# Altium project solar-charger-2420.PrjPcb
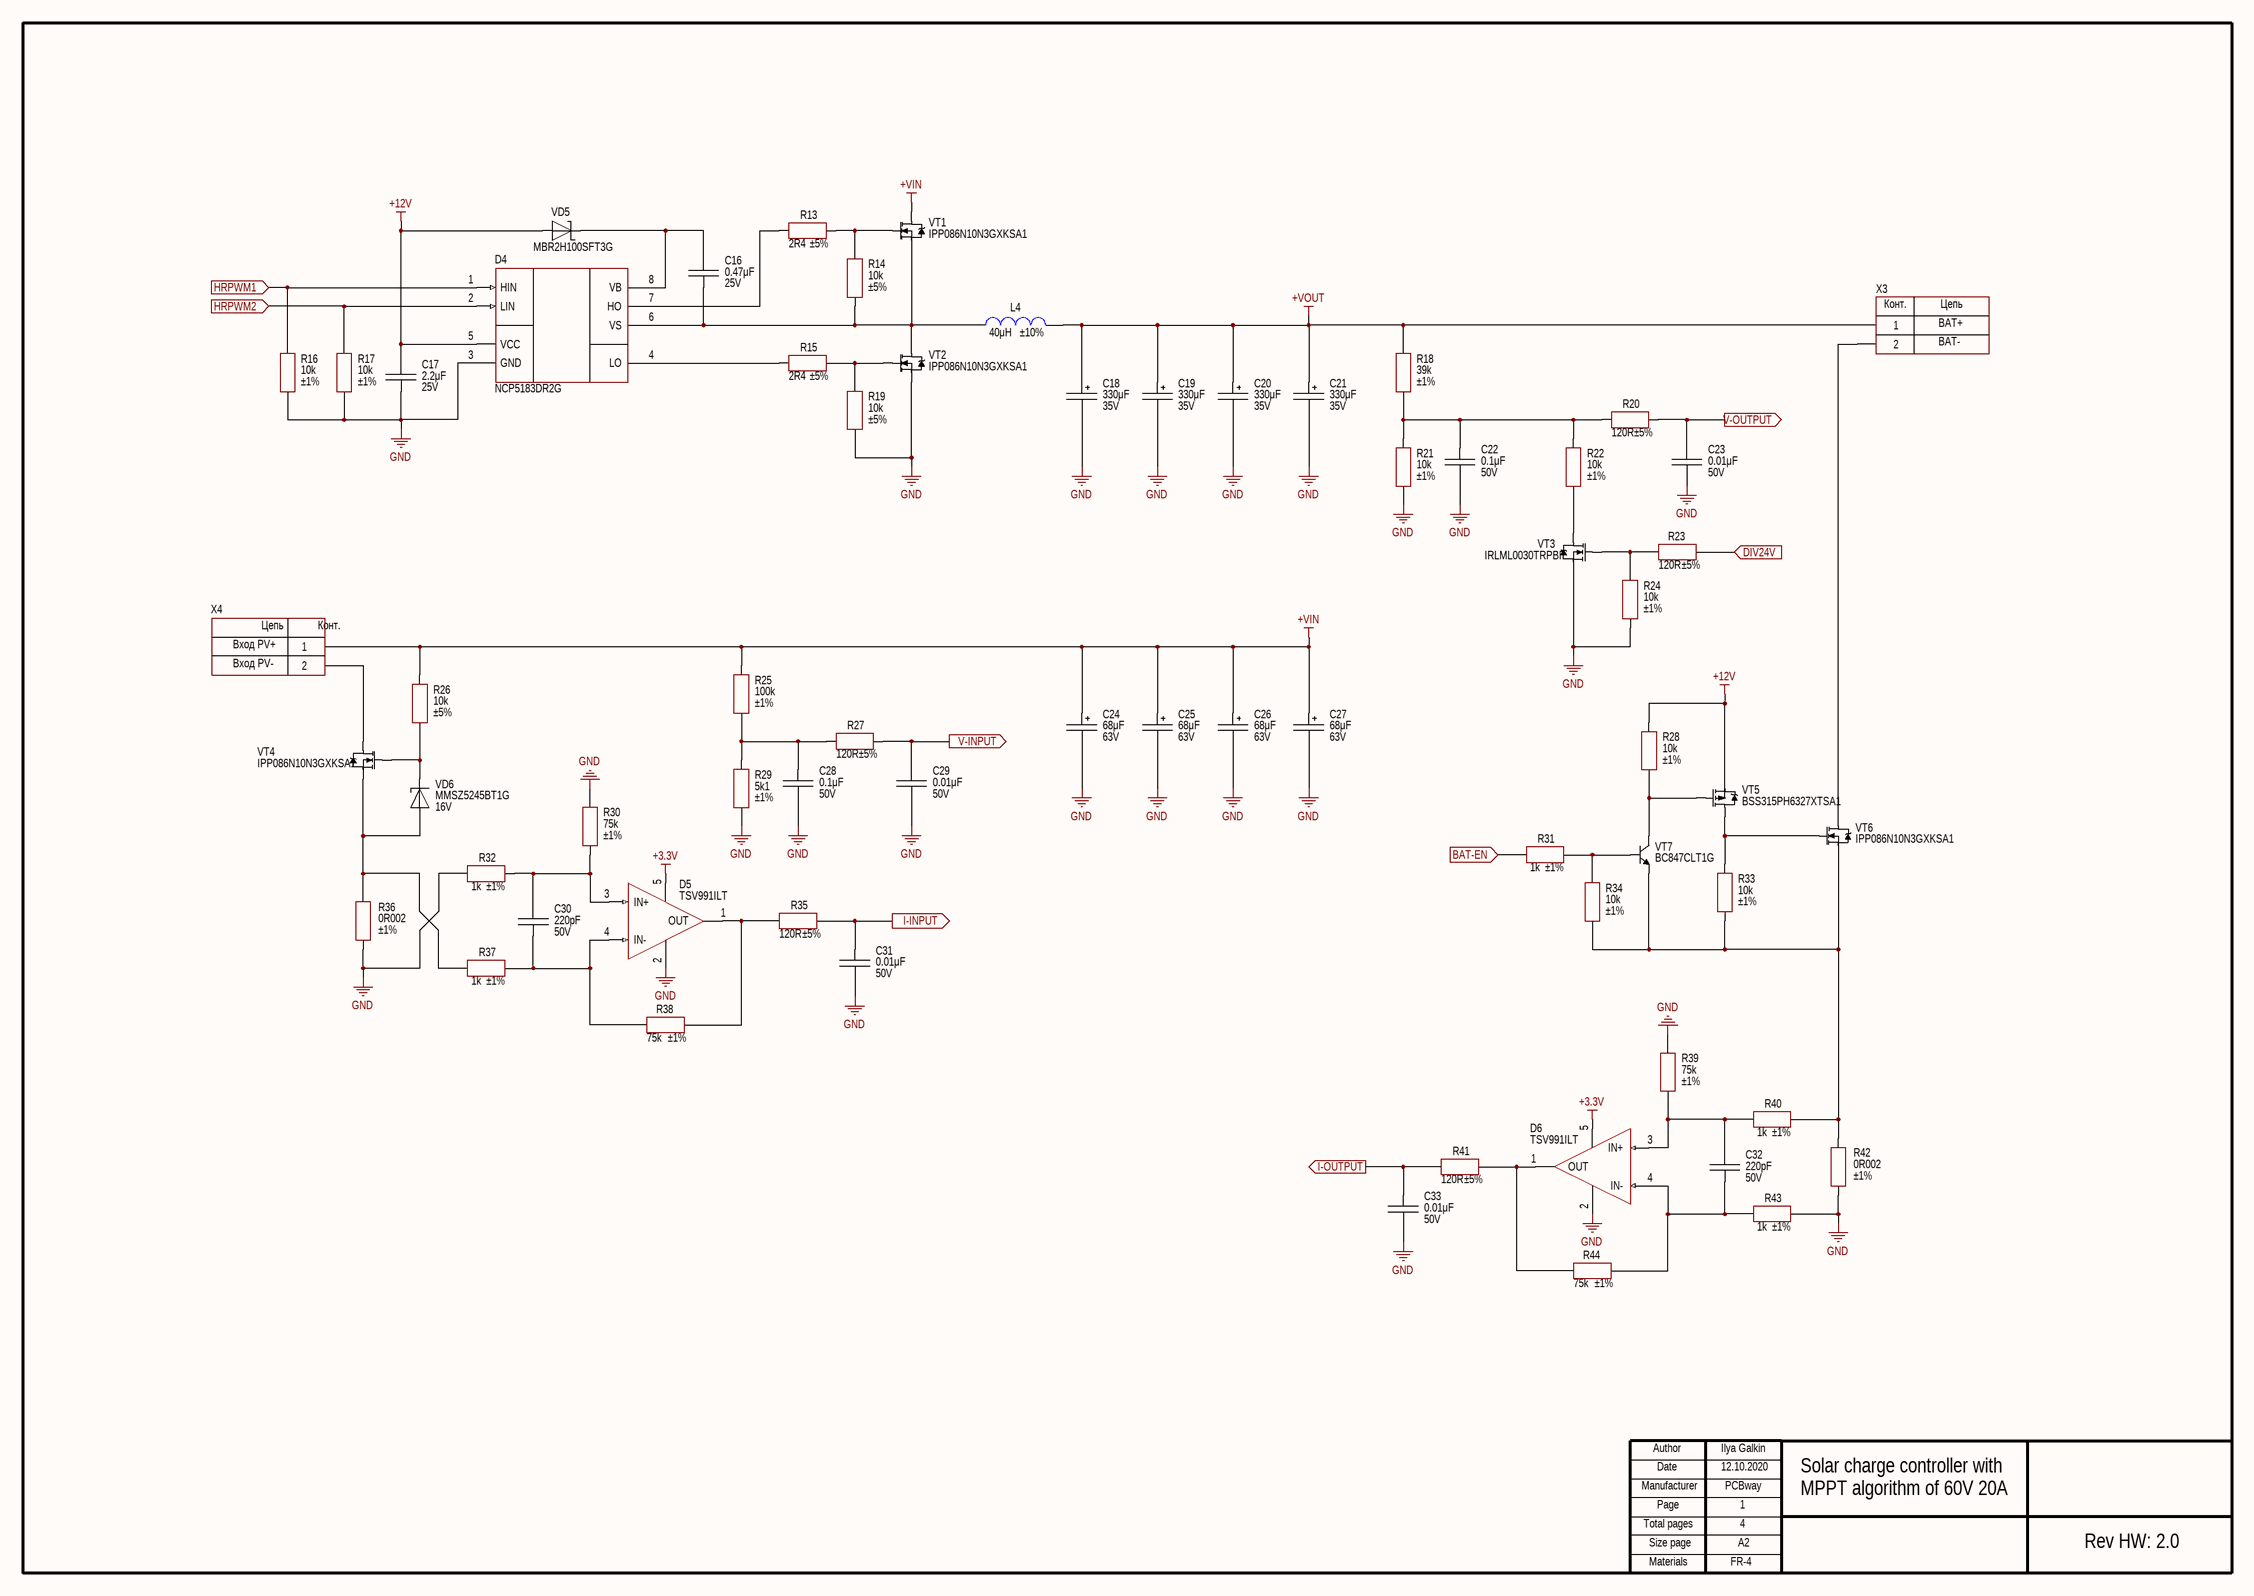
[diagram p0: power-converter.SchDoc]
4 sheets, 161 parts. Net scope: flat (ports and power ports of the same name join across sheets).
Board file: pcb.PcbDoc
Sheets:
  power-converter.SchDoc
  dsp.SchDoc
  wi-fi.SchDoc
  supply.SchDoc

## Sheet power-converter.SchDoc
size 594 x 420 mm; Address1: Address1; Address2: Address2; Address3: Address3; Address4: Address4; DocumentNumber: АБВГ.123456.001 Э3; SheetNumber: 1; SheetTotal: 4; Scale: 1:1; DocumentType: Схема электрическая принципиальная; FirstReferrence: АБВГ.123456.001

### Parts
C16  value 0.47μF  Voltage: 25V  [CAP: 0805]
C17  value 2.2μF  Voltage: 25V  [CAP: 0805]
C18  value 330μF  Voltage: 35V  [CAP: D10C5H12.5]
C19  value 330μF  Voltage: 35V  [CAP: D10C5H12.5]
C20  value 330μF  Voltage: 35V  [CAP: D10C5H12.5]
C21  value 330μF  Voltage: 35V  [CAP: D10C5H12.5]
C22  value 0.1μF  Voltage: 50V  [CAP: 0603]
C23  value 0.01μF  Voltage: 50V  [CAP: 0603]
C24  value 68μF  Voltage: 63V  [CAP: D10C5H12.5]
C25  value 68μF  Voltage: 63V  [CAP: D10C5H12.5]
C26  value 68μF  Voltage: 63V  [CAP: D10C5H12.5]
C27  value 68μF  Voltage: 63V  [CAP: D10C5H12.5]
C28  value 0.1μF  Voltage: 50V  [CAP: 0603]
C29  value 0.01μF  Voltage: 50V  [CAP: 0603]
C30  value 220pF  Voltage: 50V  [CAP: 0603]
C31  value 0.01μF  Voltage: 50V  [CAP: 0603]
C32  value 220pF  Voltage: 50V  [CAP: 0603]
C33  value 0.01μF  Voltage: 50V  [CAP: 0603]
D4  (no value)  [8-SOIC]
D5  (no value)  [SOT23-5]
D6  (no value)  [SOT23-5]
L4  value 40μH  Tolerance: ±10%  [IND: R32.8/20.1/10.7 (L)]
R13  value 2R4  Tolerance: ±5%  [RES: 0805]
R14  value 10k  Tolerance: ±5%  [RES: 0805]
R15  value 2R4  Tolerance: ±5%  [RES: 0805]
R16  value 10k  Tolerance: ±1%  [RES: 0603]
R17  value 10k  Tolerance: ±1%  [RES: 0603]
R18  value 39k  Tolerance: ±1%  [RES: 0603]
R19  value 10k  Tolerance: ±5%  [RES: 0805]
R20  value 120R  Tolerance: ±5%  [RES: 0603]
R21  value 10k  Tolerance: ±1%  [RES: 0603]
R22  value 10k  Tolerance: ±1%  [RES: 0603]
R23  value 120R  Tolerance: ±5%  [RES: 0603]
R24  value 10k  Tolerance: ±1%  [RES: 0603]
R25  value 100k  Tolerance: ±1%  [RES: 0805]
R26  value 10k  Tolerance: ±5%  [RES: 0805]
R27  value 120R  Tolerance: ±5%  [RES: 0603]
R28  value 10k  Tolerance: ±1%  [RES: 0603]
R29  value 5k1  Tolerance: ±1%  [RES: 0603]
R30  value 75k  Tolerance: ±1%  [RES: 0603]
R31  value 1k  Tolerance: ±1%  [RES: 0603]
R32  value 1k  Tolerance: ±1%  [RES: 0603]
R33  value 10k  Tolerance: ±1%  [RES: 0603]
R34  value 10k  Tolerance: ±1%  [RES: 0603]
R35  value 120R  Tolerance: ±5%  [RES: 0603]
R36  value 0R002  Tolerance: ±1%  [RES: CSS2H (2512)]
R37  value 1k  Tolerance: ±1%  [RES: 0603]
R38  value 75k  Tolerance: ±1%  [RES: 0603]
R39  value 75k  Tolerance: ±1%  [RES: 0603]
R40  value 1k  Tolerance: ±1%  [RES: 0603]
R41  value 120R  Tolerance: ±5%  [RES: 0603]
R42  value 0R002  Tolerance: ±1%  [RES: CSS2H (2512)]
R43  value 1k  Tolerance: ±1%  [RES: 0603]
R44  value 75k  Tolerance: ±1%  [RES: 0603]
VD5  PartNumber: MBR2H100SFT3G  [DIODE: SOD123F]
VD6  Voltage: 16V  PartNumber: MMSZ5245BT1G  [DIODE: SOD123]
VT1  PartNumber: IPP086N10N3GXKSA1  [TO220(H)]
VT2  PartNumber: IPP086N10N3GXKSA1  [TO220(H)]
VT3  PartNumber: IRLML0030TRPBF  [SOT23]
VT4  PartNumber: IPP086N10N3GXKSA1  [TO220(H)]
VT5  PartNumber: BSS315PH6327XTSA1  [SOT23]
VT6  PartNumber: IPP086N10N3GXKSA1  [TO220(H)]
VT7  PartNumber: BC847CLT1G  [SOT23]
X3  (no value)  [CON: XT60PW-M]
X4  (no value)  [CON: XT60PW-M]

### Ports
BAT-EN (in), DIV24V (in), HRPWM1 (in), HRPWM2 (in), I-INPUT (out), I-OUTPUT (out), V-INPUT (out), V-OUTPUT (out)

### Nets
+3.3V: D5.5(V+) D6.5(V+)
+12V: C17.2 D4.5(VCC) R28.2 VD5.1 VT5.2(S)
+VIN: C24.1 C25.1 C26.1 C27.1 R25.2 R26.2 VT1.2(D) X4.1
+VOUT: C18.1 C19.1 C20.1 C21.1 L4.1 R18.2 X3.1
GND: C17.1 C18.2 C19.2 C20.2 C21.2 C22.1 C23.1 C24.2 C25.2 C26.2 C27.2 C28.1 C29.1 C31.1 C33.1 D4.3(GND) D5.2(V-) D6.2(V-) R16.1 R17.1 R19.1 R21.1 R24.1 R29.1 R30.2 R32.1 R36.1 R39.2 R42.1 R43.2 VT2.3(S) VT3.2(S)
NetC16_1: C16.1 D4.6(VS) L4.2 R14.1 VT1.3(S) VT2.2(D)
NetC16_2: C16.2 D4.8(VB) VD5.2
NetC22_2: C22.2 R18.1 R20.1 R21.2 R22.2
NetC23_2: C23.2 R20.2 ; port V-OUTPUT
NetC28_2: C28.2 R25.1 R27.1 R29.2
NetC29_2: C29.2 R27.2 ; port V-INPUT
NetC30_1: C30.1 D5.4(IN-) R37.2 R38.2
NetC30_2: C30.2 D5.3(IN+) R30.1 R32.2
NetC31_2: C31.2 R35.2 ; port I-INPUT
NetC32_1: C32.1 D6.4(IN-) R43.1 R44.1
NetC32_2: C32.2 D6.3(IN+) R39.1 R40.1
NetC33_2: C33.2 R41.1 ; port I-OUTPUT
NetD4_1: D4.1(HIN) R16.2 ; port HRPWM1
NetD4_2: D4.2(LIN) R17.2 ; port HRPWM2
NetD4_4: D4.4(LO) R15.2
NetD4_7: D4.7(HO) R13.2
NetD5_1: D5.1(OUT) R35.1 R38.1
NetD6_1: D6.1(OUT) R41.2 R44.2
NetD7_14: R31.1 ; port BAT-EN
NetD7_16: R23.2 ; port DIV24V
NetR13_1: R13.1 R14.2 VT1.1(G)
NetR15_1: R15.1 R19.2 VT2.1(G)
NetR22_1: R22.1 VT3.3(D)
NetR23_1: R23.1 R24.2 VT3.1(G)
NetR26_1: R26.1 VD6.2(C) VT4.1(G)
NetR28_1: R28.1 VT5.1(G) VT7.3(C)
NetR31_2: R31.2 R34.2 VT7.1(B)
NetR33_1: R33.1 R34.1 R40.2 R42.2 VT6.3(S) VT7.2(E)
NetR33_2: R33.2 VT5.3(D) VT6.1(G)
NetR36_2: R36.2 R37.1 VD6.1(A) VT4.3(S)
NetVT4_2: VT4.2(D) X4.2
NetVT6_2: VT6.2(D) X3.2

### Notes on the sheet
- BAT+
- BAT-
- Вход PV+
- Вход PV-
- Ilya Galkin
- 12.10.2020
- PCBway
- 1
- Solar charge controller with
- MPPT algorithm of 60V 20A
- 4
- Rev HW: 2.0
- FR-4
- Author
- Manufacturer
- Date
- Page
- Total pages
- Size page
- A2
- Materials
- (in symbol Connector_XT_2pin) Цепь; Конт.

### Library data of the parts
C16 = Ceramic_0805: Manufacturer: Samsung; PartNumber: CL21B474KAFNNNG; ValueManufacturerPartNumber: Ceramic capacitor, 0.47μF, X7R, ±10%, 25V, 0805, -55...+125°C; TypeCapacitor: Ceramic capacitor; Tolerance: ±10%; TypeDielectric: X7R; Package: 0805; HelpURL: https://www.digikey.com/product-detail/en/samsung-electro-mechanics/CL21B474KAFNNNG/1276-6480-1-ND/5958108; Temperature: -55...+125°C
C17 = Ceramic_0805: Manufacturer: Samsung; PartNumber: CL21B225KAFNFNE; ValueManufacturerPartNumber: Ceramic capacitor, 2.2μF, X7R, ±10%, 25V, 0805, -55...+125°C; TypeCapacitor: Ceramic capacitor; Tolerance: ±10%; TypeDielectric: X7R; Package: 0805; HelpURL: https://www.digikey.com/product-detail/en/samsung-electro-mechanics/CL21B225KAFNFNE/1276-2953-1-ND/3891039; Temperature: -55...+125°C
C18-C21 = Aluminium: Manufacturer: Panasonic; PartNumber: 35SEK330M; ValueManufacturerPartNumber: Solid polymer capacitor, 330μF, 35V, ±20%, 18mOhm, 13x10x5 mm, -55...+105°C; TypeCapacitor: Solid polymer capacitor; Tolerance: ±20%; Impedance: 18mOhm; Package: 13x10x5 mm; HelpURL: https://www.digikey.com/product-detail/en/panasonic-electronic-components/35SEK330M/P122629-ND/8030545; Temperature: -55...+105°C
C22 C28 = Ceramic_0603: Manufacturer: Samsung; PartNumber: CL10B104KB8WPND; ValueManufacturerPartNumber: Ceramic capacitor, 0.1μF, X7R, ±10%, 50V, 0603, -55...+125°C; TypeCapacitor: Ceramic capacitor; Tolerance: ±10%; TypeDielectric: X7R; Package: 0603; HelpURL: https://www.digikey.com/product-detail/en/samsung-electro-mechanics/CL10B104KB8WPND/1276-CL10B104KB8WPNDCT-ND/11488014; Temperature: -55...+125°C
C23 C29 C31 C33 = Ceramic_0603: Manufacturer: Samsung; PartNumber: CL10B103KB8NNNC; ValueManufacturerPartNumber: Ceramic capacitor, 0.01μF, X7R, ±10%, 50V, 0603, -55...+125°C; TypeCapacitor: Ceramic capacitor; Tolerance: ±10%; TypeDielectric: X7R; Package: 0603; HelpURL: https://www.digikey.com/product-detail/en/samsung-electro-mechanics/CL10B103KB8NNNC/1276-1009-1-ND/3889095; Temperature: -55...+125°C
C24-C27 = Aluminium: Manufacturer: Panasonic; PartNumber: 63SXE68M; ValueManufacturerPartNumber: Solid polymer capacitor, 68μF, 63V, ±20%, 25mOhm, 13x10x5 mm, -55...+105°C; TypeCapacitor: Solid polymer capacitor; Tolerance: ±20%; Impedance: 25mOhm; Package: 13x10x5 mm; HelpURL: https://www.digikey.com/products/en?keywords=63SXE68M; Temperature: -55...+105°C
C30 C32 = Ceramic_0603: Manufacturer: Samsung; PartNumber: CL10B221KB8NFNC; ValueManufacturerPartNumber: Ceramic capacitor, 220pF, X7R, ±10%, 50V, 0603, -55...+125°C; TypeCapacitor: Ceramic capacitor; Tolerance: ±10%; TypeDielectric: X7R; Package: 0603; HelpURL: https://www.digikey.com/product-detail/en/samsung-electro-mechanics/CL10B221KB8NFNC/1276-1986-1-ND/3890072; Temperature: -55...+125°C
D4 = NCP5183DR2G: Gate driver; Manufacturer: ON Semiconductor; ValueManufacturerPartNumber: Half-bridge gate driver, 600V, 500kHz, ±4.3A, supply 9...18V, -40...+125°C, 8-SOIC; VoltageSupply: supply 9...18V; Frequency: 500kHz; CurrentOutput: ±4.3A; VoltageWork: 600V; HelpURL: https://www.digikey.com/product-detail/en/on-semiconductor/NCP5183DR2G/NCP5183DR2GOSCT-ND/7066807; Package: 8-SOIC; ComponentType: Half-bridge gate driver; Temperature: -40...+125°C; PartNumber: NCP5183DR2G
D5 D6 = TSV991ILT: OP amplifier; Manufacturer: STMicroelectronics; ValueManufacturerPartNumber: IC op amplifier, Rail-to-Rail, 20 MHz, 2.7...5.5V, -40...+125°C, SOT23-5; Supply: 2.7...5.5V; OutputType: Rail-to-Rail; GainBandwidth: 20 MHz; HelpURL: https://www.digikey.com/product-detail/en/stmicroelectronics/TSV991ILT/497-6001-1-ND/1578484; Package: SOT23-5; ComponentType: IC op amplifier; Temperature: -40...+125°C; PartNumber: TSV991ILT
L4 = Inductor_R32.8/20.1/10.7: Manufacturer: Magnetics; PartNumber: 0077548A7; ValueManufacturerPartNumber: Fixed inductor, 40μH, ±10%, R32.8/20.1/10.7, Kool Mu, µ=125, 127 нГн/витков2; TypeInductor: Fixed inductor; TypeMatiriel: Kool Mu; AL: 127 нГн/витков2; MaterialPermeability: µ=125; Package: R32.8/20.1/10.7; HelpURL: http://ferrite.ru/warehouse/r-32-820-110-7-77548-a7.html
R13 R15 = Resistor_0805: Manufacturer: Yageo; PartNumber: RC0805JR-072R4L; ValueManufacturerPartNumber: Resistor film, 2R4, ±5%, 0805, 0.125W, -55...+125°C; TypeResistor: Resistor film; Power: 0.125W; Package: 0805; HelpURL: https://www.digikey.com/product-detail/en/yageo/RC0805JR-072R4L/311-2.4ARCT-ND/731220; Temperature: -55...+125°C
R14 R19 R26 = Resistor_0805: Manufacturer: Yageo; PartNumber: RC0805JR-0710KL; ValueManufacturerPartNumber: Resistor film, 10k, ±5%, 0805, 0.125W, -55...+125°C; TypeResistor: Resistor film; Power: 0.125W; Package: 0805; HelpURL: https://www.digikey.com/product-detail/en/yageo/RC0805JR-0710KL/311-10KARCT-ND/731188; Temperature: -55...+125°C
R16 R17 R21 R22 R24 R28 R33 R34 = Resistor_0603: Manufacturer: Yageo; PartNumber: AC0603FR-0710KL; ValueManufacturerPartNumber: Resistor film, 10k, ±1%, 0603, 0.1W, -55...+125°C; TypeResistor: Resistor film; Power: 0.1W; Package: 0603; HelpURL: https://www.digikey.com/en/products/detail/yageo/AC0603FR-0710KL/2827814; Temperature: -55...+125°C
R18 = Resistor_0603: Manufacturer: Yageo; PartNumber: RC0603FR-0739KL; ValueManufacturerPartNumber: Resistor film, 39k, ±1%, 0603, 0.1W, -55...+125°C; TypeResistor: Resistor film; Power: 0.1W; Package: 0603; HelpURL: https://www.digikey.com/en/products/detail/yageo/RC0603FR-0739KL/727195?s=N4IgTCBcDaIEoGEAMA2JBmAYnAtEg7OgJwDSAMiALoC%2BQA; Temperature: -55...+125°C
R20 R23 R27 R35 R41 = Resistor_0603: Manufacturer: Yageo; PartNumber: RC0603JR-07120RL; ValueManufacturerPartNumber: Resistor film, 120R, ±5%, 0603, 0.1W, -55...+125°C; TypeResistor: Resistor film; Power: 0.1W; Package: 0603; HelpURL: https://www.digikey.com/product-detail/en/yageo/RC0603JR-07120RL/311-120GRCT-ND/729653; Temperature: -55...+125°C
R25 = Resistor_0805: Manufacturer: Yageo; PartNumber: RC0805FR-07100KL; ValueManufacturerPartNumber: Resistor film, 100k, ±1%, 0805, 0.125W, -55...+125°C; TypeResistor: Resistor film; Power: 0.125W; Package: 0805; HelpURL: https://www.digikey.com/product-detail/en/yageo/RC0805FR-07100KL/311-100KCRCT-ND/730491; Temperature: -55...+125°C
R29 = Resistor_0603: Manufacturer: Yageo; PartNumber: RC0603FR-075K1L; ValueManufacturerPartNumber: Resistor film, 5k1, ±1%, 0603, 0.1W, -55...+125°C; TypeResistor: Resistor film; Power: 0.1W; Package: 0603; HelpURL: https://www.digikey.com/en/products/detail/yageo/RC0603FR-075K1L/727268?s=N4IgTCBcDaIEoGEAMA2JBmAYnAtEg7AKwDSAjADIgC6AvkA; Temperature: -55...+125°C
R30 R38 R39 R44 = Resistor_0603: Manufacturer: Yageo; PartNumber: AC0603FR-0775KL; ValueManufacturerPartNumber: Resistor film, 75k, ±1%, 0603, 0.1W, -55...+125°C; TypeResistor: Resistor film; Power: 0.1W; Package: 0603; HelpURL: https://www.digikey.com/en/products/detail/yageo/AC0603FR-0775KL/5896284; Temperature: -55...+125°C
R31 R32 R37 R40 R43 = Resistor_0603: Manufacturer: Yageo; PartNumber: RC0603FR-071KL; ValueManufacturerPartNumber: Resistor film, 1k, ±1%, 0603, 0.1W, -55...+125°C; TypeResistor: Resistor film; Power: 0.1W; Package: 0603; HelpURL: https://www.digikey.com/product-detail/en/yageo/RC0603FR-071KL/311-1-00KHRCT-ND/729790; Temperature: -55...+125°C
R36 R42 = Shunt: Manufacturer: Yageo; PartNumber: PA2512FKM7W0R002E; ValueManufacturerPartNumber: Resistor film, 0R002, ±1%, 2512, 2W, -55...+170°C; TypeResistor: Resistor film; Power: 2W; Package: 2512; HelpURL: https://www.digikey.com/en/products/detail/yageo/PA2512FKM7W0R002E/9696342; Temperature: -55...+170°C
VD5 = Schottky_single: Manufacturer: ON Semiconductor; ValueManufacturerPartNumber: Schottky diode, 100V, 2A, 840mV, 15pF, SOD-123F, -55...+150°C; TypeDiode: Schottky diode; Voltage: 100V; Current: 2A; VoltageDrop: 840mV; RecoveryTime: 15pF; Package: SOD-123F; HelpURL: https://www.digikey.com/product-detail/en/on-semiconductor/MBR2H100SFT3G/MBR2H100SFT3GOSCT-ND/3462288; Temperature: -55...+150°C
VD6 = Zener_single: Manufacturer: ON Semiconductor; ValueManufacturerPartNumber: Zener diode, 16V, 500mW, 0.9V, 16Ohm, SOD-123, -55...+150°C; TypeDiode: Zener diode; Current: 500mW; VoltageDrop: 0.9V; RecoveryTime: 16Ohm; Package: SOD-123; HelpURL: https://www.digikey.com/product-detail/en/on-semiconductor/MMSZ5245BT1G/MMSZ5245BT1GOSCT-ND/1139899; Temperature: -55...+150°C
VT1 VT2 VT4 VT6 = MOSFET_N_123: Manufacturer: Infineon Technologies; ValueManufacturerPartNumber: MOSFET N-channel transistor, 100V, 80A, 55nC, 125W, 8.6mOhm, 3980pF, TO-220, -55...+150°C; TypeTransistor: MOSFET N-channel transistor; VoltageDS: 100V; CurrentDS: 80A; RDS: 8.6mOhm; GateCharge: 55nC; InputCapacitor: 3980pF; MaxPower: 125W; Package: TO-220; HelpURL: https://www.digikey.com/en/products/detail/infineon-technologies/IPP086N10N3GXKSA1/2081155; Temperature: -55...+150°C
VT3 = MOSFET_N_132: Manufacturer: Infineon Technologies; ValueManufacturerPartNumber: MOSFET N-channel transistor, 30V, 5.3A, 2.6nC, 1.3W, 27mOhm, 382pF, SOT-23, -55...+150°C; TypeTransistor: MOSFET N-channel transistor; VoltageDS: 30V; CurrentDS: 5.3A; RDS: 27mOhm; GateCharge: 2.6nC; InputCapacitor: 382pF; MaxPower: 1.3W; Package: SOT-23; HelpURL: https://www.digikey.com/product-detail/en/infineon-technologies/IRLML0030TRPBF/IRLML0030TRPBFCT-ND/2202231; Temperature: -55...+150°C
VT5 = MOSFET_P_132: Manufacturer: Infineon Technologies; ValueManufacturerPartNumber: MOSFET P-channel transistor, 30V, 1.5A, 2.3nC, 500mW, 150mOhm, 282pF, SOT-23, -55...+150°C; TypeTransistor: MOSFET P-channel transistor; VoltageDS: 30V; CurrentDS: 1.5A; RDS: 150mOhm; GateCharge: 2.3nC; InputCapacitor: 282pF; MaxPower: 500mW; Package: SOT-23; HelpURL: https://www.digikey.com/en/products/detail/infineon-technologies/BSS315PH6327XTSA1/2783468; Temperature: -55...+150°C
VT7 = BJT_NPN_132: Manufacturer: ON Semiconductor; ValueManufacturerPartNumber: NPN transistor, 45V, 100mA, 100MHz, 300mW, 0.6V, 420, SOT-23, -55...+125°C; TypeTransistor: NPN transistor; VoltageCE: 45V; CurrentCE: 100mA; VoltageSaturation: 0.6V; Frequency: 100MHz; CurrentGain: 420; MaxPower: 300mW; Package: SOT-23; HelpURL: https://www.digikey.com/product-detail/en/on-semiconductor/BC847CLT1G/BC847CLT1GOSCT-ND/917836; Temperature: -55...+125°C
X3 X4 = Connector_XT_2pin: Manufacturer: AMASS; ValueManufacturerPartNumber: Power connector, 2pin, 7.2mm, 500V, 60A; PartNumber: XT60PW-M; TypeConnector: Power connector; VoltageMax: 500V; Pitch: 7.2mm; CurrentMax: 60A; Multichannel: 2pin; CommentText: "Разъем"; HelpURL: https://lcsc.com/product-detail/Connectors_Changzhou-Amass-Elec-XT60PW-M_C98732.html

## Sheet dsp.SchDoc
size 594 x 420 mm; Address1: Address1; Address2: Address2; Address3: Address3; Address4: Address4; DocumentNumber: АБВГ.123456.001 Э3; SheetNumber: 2; SheetTotal: 4; Scale: 1:1; DocumentType: Схема электрическая принципиальная; FirstReferrence: АБВГ.123456.001
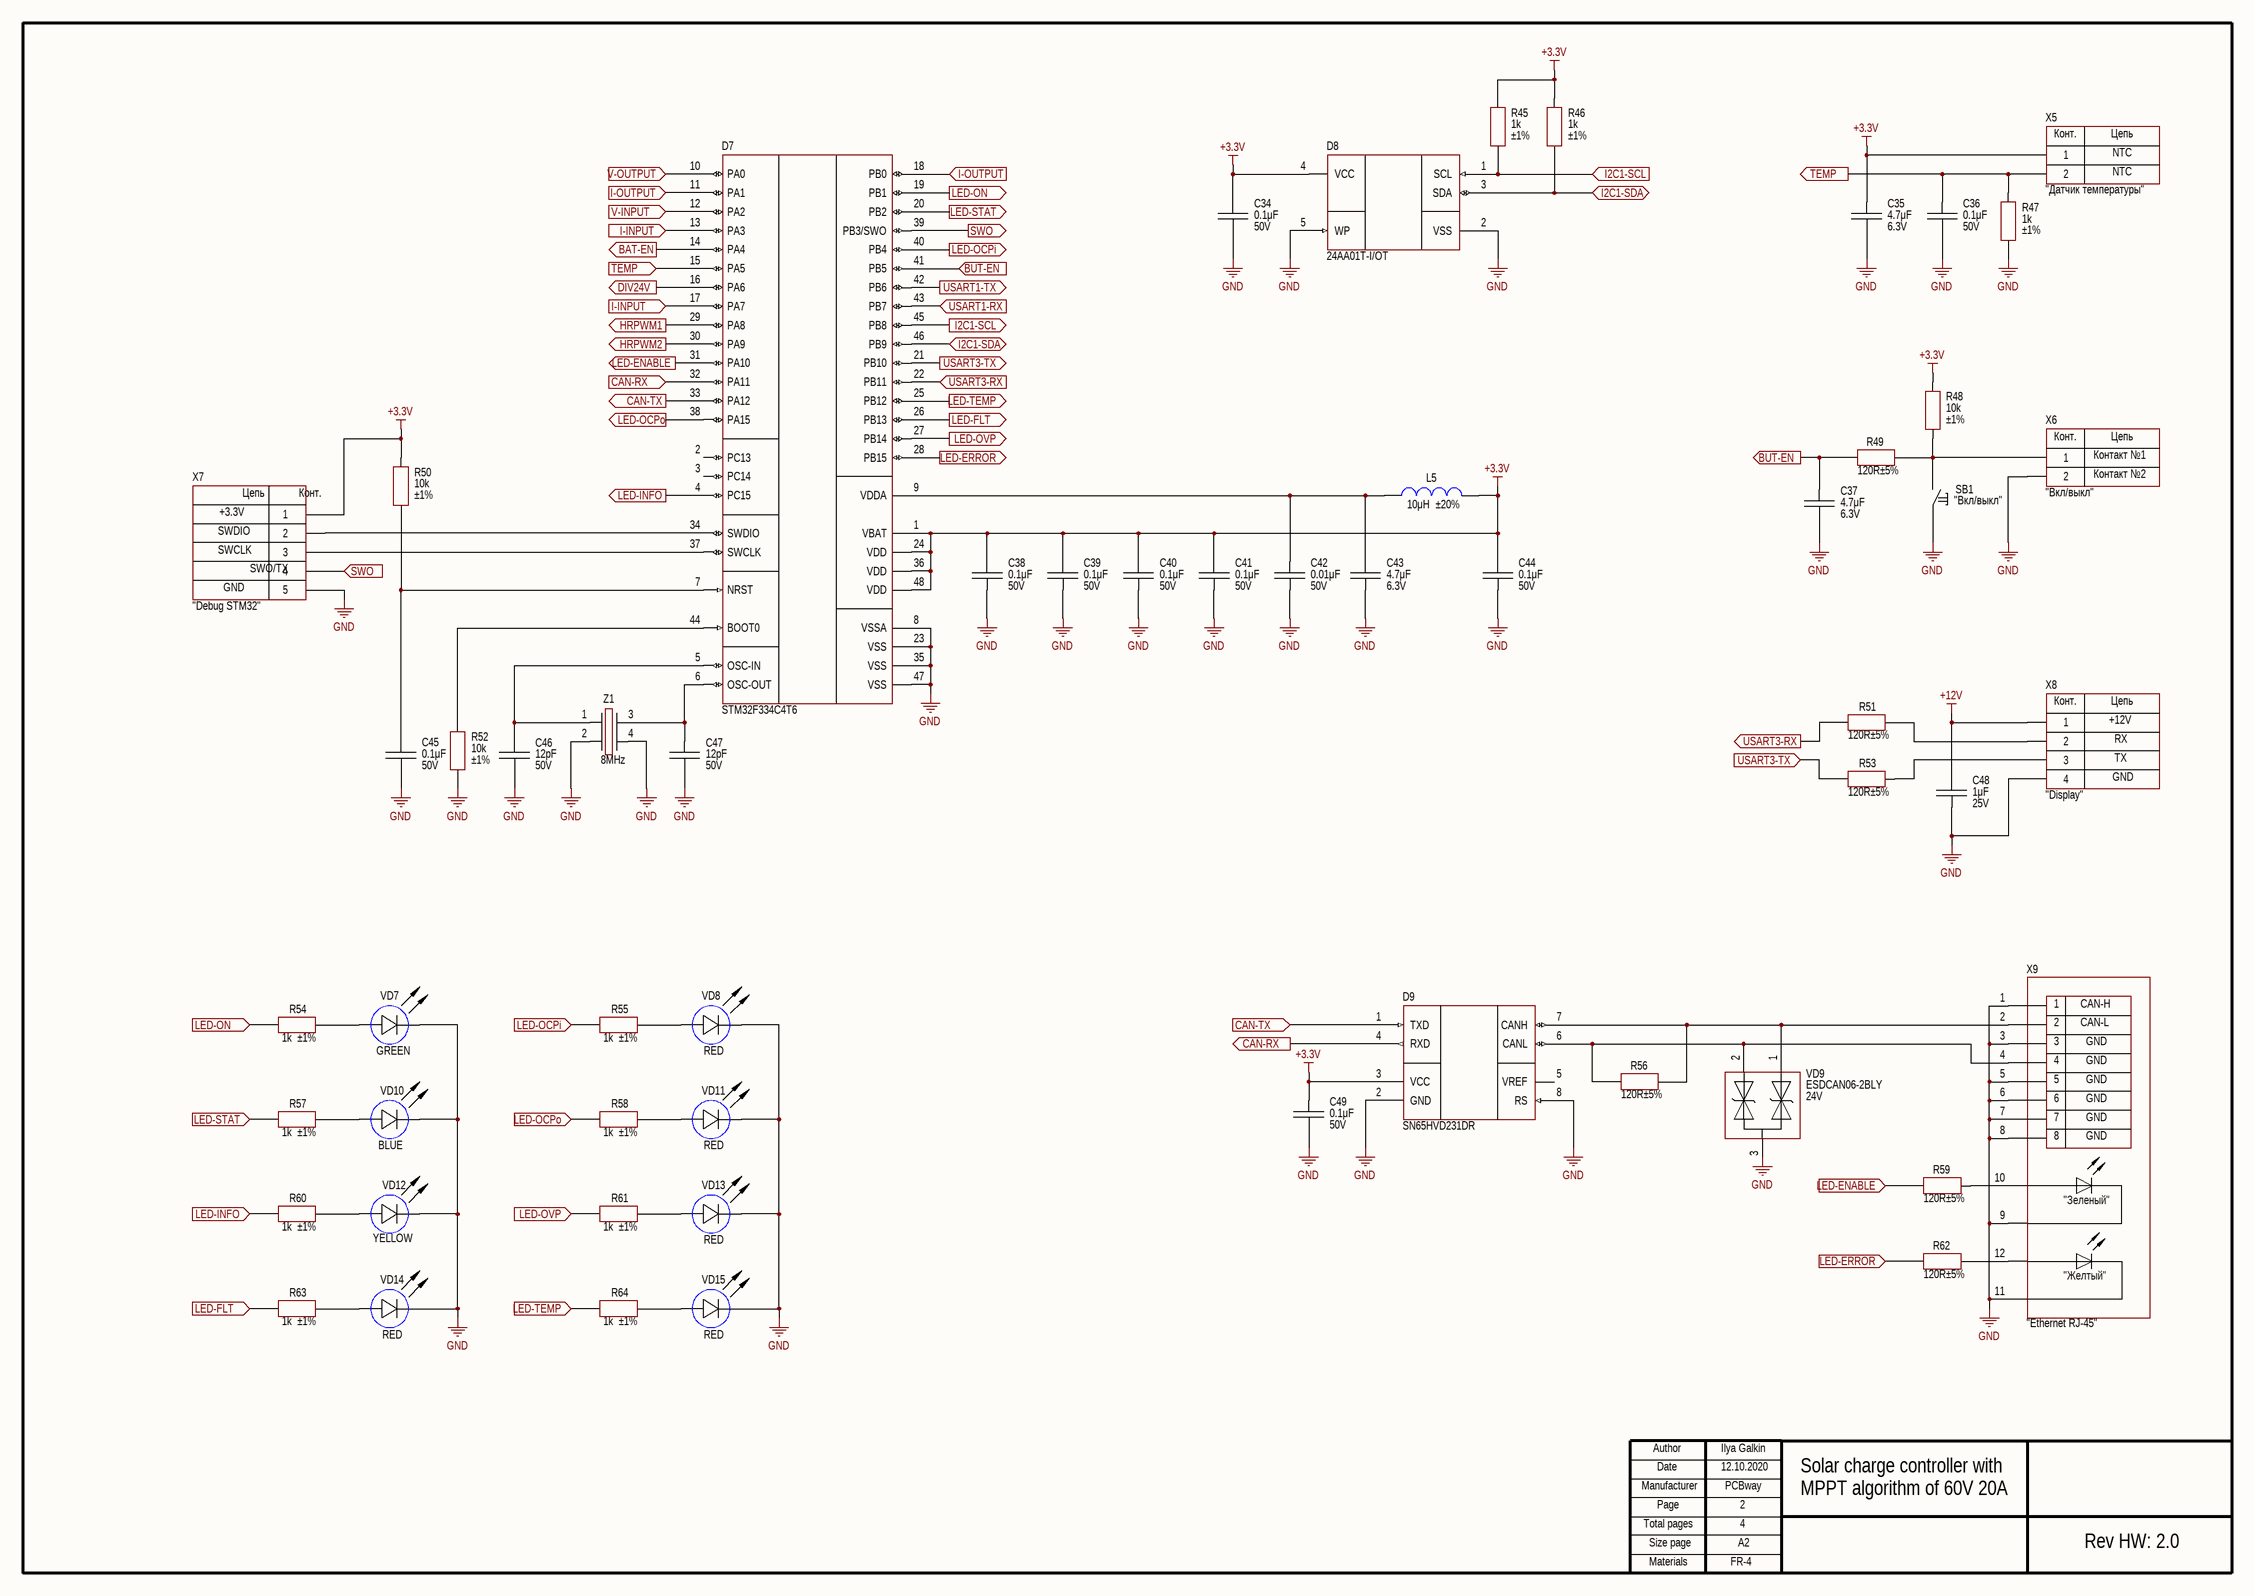
[diagram p1: dsp.SchDoc]

### Parts
C34  value 0.1μF  Voltage: 50V  [CAP: 0603]
C35  value 4.7μF  Voltage: 6.3V  [CAP: 0603]
C36  value 0.1μF  Voltage: 50V  [CAP: 0603]
C37  value 4.7μF  Voltage: 6.3V  [CAP: 0603]
C38  value 0.1μF  Voltage: 50V  [CAP: 0603]
C39  value 0.1μF  Voltage: 50V  [CAP: 0603]
C40  value 0.1μF  Voltage: 50V  [CAP: 0603]
C41  value 0.1μF  Voltage: 50V  [CAP: 0603]
C42  value 0.01μF  Voltage: 50V  [CAP: 0603]
C43  value 4.7μF  Voltage: 6.3V  [CAP: 0603]
C44  value 0.1μF  Voltage: 50V  [CAP: 0603]
C45  value 0.1μF  Voltage: 50V  [CAP: 0603]
C46  value 12pF  Voltage: 50V  [CAP: 0603]
C47  value 12pF  Voltage: 50V  [CAP: 0603]
C48  value 1μF  Voltage: 25V  [CAP: 0603]
C49  value 0.1μF  Voltage: 50V  [CAP: 0603]
D7  PartNumber: STM32F334C4T6  [48-LQFP]
D8  PartNumber: 24AA01T-I/OT  [SOT23-5]
D9  (no value)  [8-SOIC]
L5  value 10μH  Tolerance: ±20%  [IND: 0603]
R45  value 1k  Tolerance: ±1%  [RES: 0603]
R46  value 1k  Tolerance: ±1%  [RES: 0603]
R47  value 1k  Tolerance: ±1%  [RES: 0603]
R48  value 10k  Tolerance: ±1%  [RES: 0603]
R49  value 120R  Tolerance: ±5%  [RES: 0603]
R50  value 10k  Tolerance: ±1%  [RES: 0603]
R51  value 120R  Tolerance: ±5%  [RES: 0603]
R52  value 10k  Tolerance: ±1%  [RES: 0603]
R53  value 120R  Tolerance: ±5%  [RES: 0603]
R54  value 1k  Tolerance: ±1%  [RES: 0603]
R55  value 1k  Tolerance: ±1%  [RES: 0603]
R56  value 120R  Tolerance: ±5%  [RES: 0603]
R57  value 1k  Tolerance: ±1%  [RES: 0603]
R58  value 1k  Tolerance: ±1%  [RES: 0603]
R59  value 120R  Tolerance: ±5%  [RES: 0603]
R60  value 1k  Tolerance: ±1%  [RES: 0603]
R61  value 1k  Tolerance: ±1%  [RES: 0603]
R62  value 120R  Tolerance: ±5%  [RES: 0603]
R63  value 1k  Tolerance: ±1%  [RES: 0603]
R64  value 1k  Tolerance: ±1%  [RES: 0603]
SB1  CommentText: "Вкл/выкл"  [BUT: 6x3.5 SMD]
VD7  Color: GREEN  [LED: 0603G]
VD8  Color: RED  [LED: 0603R]
VD9  Voltage: 24V  PartNumber: ESDCAN06-2BLY  [SOT23]
VD10  Color: BLUE  [LED: 0603B]
VD11  Color: RED  [LED: 0603R]
VD12  Color: YELLOW  [LED: 0603Y]
VD13  Color: RED  [LED: 0603R]
VD14  Color: RED  [LED: 0603R]
VD15  Color: RED  [LED: 0603R]
X5  CommentText: "Датчик температуры"  [CON: CWF-2]
X6  CommentText: "Вкл/выкл"  [CON: CWF-2]
X7  CommentText: "Debug STM32"  [CON: SM05B-GHS]
X8  CommentText: "Display"  [CON: CWF-4]
X9  CommentText: "Ethernet RJ-45"  [CON: RJ-45 (615008137421 / DS1128-09-S8B8S)]
Z1  Frequency: 8MHz  [OSC: 3225]

### Ports
BAT-EN (out), BUT-EN (in), BUT-EN (out), CAN-RX (in), CAN-RX (out), CAN-TX (in), CAN-TX (out), DIV24V (out), HRPWM1 (out), HRPWM2 (out), I2C1-SCL (in), I2C1-SCL (out), I2C1-SDA (bidir), I-INPUT (in), I-OUTPUT (in), LED-ENABLE (in), LED-ENABLE (out), LED-ERROR (in), LED-ERROR (out), LED-FLT (in), LED-FLT (out), LED-INFO (in), LED-INFO (out), LED-OCPi (in), LED-OCPi (out), LED-OCPo (in), LED-OCPo (out), LED-ON (in), LED-ON (out), LED-OVP (in), LED-OVP (out), LED-STAT (in), LED-STAT (out), LED-TEMP (in), LED-TEMP (out), SWO (in), SWO (out), TEMP (in), TEMP (out), USART1-RX (in), USART1-TX (out), USART3-RX (in), USART3-RX (out), USART3-TX (in), USART3-TX (out), V-INPUT (in), V-OUTPUT (in)

### Nets
+3.3V: C34.2 C35.2 C38.2 C39.2 C40.2 C41.2 C44.2 C49.2 D7.1(VBAT) D7.24(VDD) D7.36(VDD) D7.48(VDD) D8.4(VCC) D9.3(VCC) L5.2 R45.2 R46.2 R48.2 R50.2 X5.1 X7.1
+12V: C48.2 X8.1
GND: C34.1 C35.1 C36.1 C37.1 C38.1 C39.1 C40.1 C41.1 C42.1 C43.1 C44.1 C45.1 C46.1 C47.1 C48.1 C49.1 D7.8(VSSA) D7.23(VSS) D7.35(VSS) D7.47(VSS) D8.2(VSS) D8.5(WP) D9.2(GND) D9.8(RS) R47.1 R52.1 SB1.1 VD7.2(C) VD8.2(C) VD9.3 VD10.2(C) VD11.2(C) VD12.2(C) VD13.2(C) VD14.2(C) VD15.2(C) X6.2 X7.5 X8.4 X9.1(D2) X9.3(D2) X9.5(D2) X9.6(D2) X9.7(D2) X9.8(D2) X9.9(D2) X9.11(D3) Z1.2 Z1.4
NetC23_2: D7.10(PA0) ; port V-OUTPUT
NetC29_2: D7.12(PA2) ; port V-INPUT
NetC31_2: D7.13(PA3) D7.17(PA7) ; port I-INPUT
NetC33_2: D7.11(PA1) D7.18(PB0) ; port I-OUTPUT
NetC36_2: C36.2 D7.15(PA5) R47.2 X5.2 ; port TEMP
NetC37_2: C37.2 D7.41(PB5) R49.1 ; port BUT-EN
NetC42_2: C42.2 C43.2 D7.9(VDDA) L5.1
NetC45_2: C45.2 D7.7(NRST) R50.1
NetC46_2: C46.2 D7.5(OSC-IN) Z1.1
NetC47_2: C47.2 D7.6(OSC-OUT) Z1.3
NetD4_1: D7.29(PA8) ; port HRPWM1
NetD4_2: D7.30(PA9) ; port HRPWM2
NetD7_4: D7.4(PC15) R60.2 ; port LED-INFO
NetD7_14: D7.14(PA4) ; port BAT-EN
NetD7_16: D7.16(PA6) ; port DIV24V
NetD7_19: D7.19(PB1) R54.2 ; port LED-ON
NetD7_20: D7.20(PB2) R57.2 ; port LED-STAT
NetD7_21: D7.21(PB10) R53.1 ; port USART3-TX
NetD7_22: D7.22(PB11) R51.1 ; port USART3-RX
NetD7_25: D7.25(PB12) R64.2 ; port LED-TEMP
NetD7_26: D7.26(PB13) R63.2 ; port LED-FLT
NetD7_27: D7.27(PB14) R61.2 ; port LED-OVP
NetD7_28: D7.28(PB15) R62.1 ; port LED-ERROR
NetD7_31: D7.31(PA10) R59.1 ; port LED-ENABLE
NetD7_32: D7.32(PA11) D9.4(RXD) ; port CAN-RX
NetD7_33: D7.33(PA12) D9.1(TXD) ; port CAN-TX
NetD7_34: D7.34(SWDIO) X7.2
NetD7_37: D7.37(SWCLK) X7.3
NetD7_38: D7.38(PA15) R58.2 ; port LED-OCPo
NetD7_39: D7.39(PB3/SWO) X7.4 ; port SWO
NetD7_40: D7.40(PB4) R55.2 ; port LED-OCPi
NetD7_42: D7.42(PB6) ; port USART1-TX
NetD7_43: D7.43(PB7) ; port USART1-RX
NetD7_44: D7.44(BOOT0) R52.2
NetD7_45: D7.45(PB8) D8.1(SCL) R45.1 ; port I2C1-SCL
NetD7_46: D7.46(PB9) D8.3(SDA) R46.1 ; port I2C1-SDA
NetD9_6: D9.6(CANL) R56.1 VD9.2 X9.4(D2)
NetD9_7: D9.7(CANH) R56.2 VD9.1 X9.2(D2)
NetR48_1: R48.1 R49.2 SB1.2 X6.1
NetR51_2: R51.2 X8.2
NetR53_2: R53.2 X8.3
NetR54_1: R54.1 VD7.1(A)
NetR55_1: R55.1 VD8.1(A)
NetR57_1: R57.1 VD10.1(A)
NetR58_1: R58.1 VD11.1(A)
NetR59_2: R59.2 X9.10(D1)
NetR60_1: R60.1 VD12.1(A)
NetR61_1: R61.1 VD13.1(A)
NetR62_2: R62.2 X9.12(D4)
NetR63_1: R63.1 VD14.1(A)
NetR64_1: R64.1 VD15.1(A)

Not connected (* = marked no-connect by the designer): D7 2(PC13) 3(PC14); D9 5(VREF)

### Notes on the sheet
- NTC
- Контакт №1
- Контакт №2
- SWCLK
- SWDIO
- +3.3V
- GND
- SWO/TX
- +12V
- RX
- TX
- CAN-H
- CAN-L
- Ilya Galkin
- 12.10.2020
- PCBway
- 2
- Solar charge controller with
- MPPT algorithm of 60V 20A
- 4
- Rev HW: 2.0
- FR-4
- Author
- Manufacturer
- Date
- Page
- Total pages
- Size page
- A2
- Materials
- (in symbol Connector_RJ45) "Зеленый"; "Желтый"
- (in symbol Connector_SM05B) Цепь; Конт.
- (in symbol CWF-2) Конт.; Цепь
- (in symbol CWF-4) Конт.; Цепь

### Library data of the parts
C34 C36 = Ceramic_0603: Manufacturer: Yageo; PartNumber: CL10B104KB8WPND; ValueManufacturerPartNumber: Ceramic capacitor, 0.1μF, X7R, ±10%, 50V, 0603, -55...+125°C; TypeCapacitor: Ceramic capacitor; Tolerance: ±10%; TypeDielectric: X7R; Package: 0603; HelpURL: https://www.digikey.com/product-detail/en/samsung-electro-mechanics/CL10B104KB8WPND/1276-CL10B104KB8WPNDCT-ND/11488014; Temperature: -55...+125°C
C35 C37 C43 = Ceramic_0603: Manufacturer: Samsung; PartNumber: CL10B475KQ8NQNC; ValueManufacturerPartNumber: Ceramic capacitor, 4.7μF, X7R, ±10%, 6.3V, 0603, -55...+125°C; TypeCapacitor: Ceramic capacitor; Tolerance: ±10%; TypeDielectric: X7R; Package: 0603; HelpURL: https://www.digikey.com/en/products/detail/samsung-electro-mechanics/CL10B475KQ8NQNC/3887745; Temperature: -55...+125°C
C38-C41 C44 C45 C49 = Ceramic_0603: as C22 on sheet power-converter; Package: 0603; HelpURL: https://www.digikey.com/product-detail/en/samsung-electro-mechanics/CL10B104KB8WPND/1276-CL10B104KB8WPNDCT-ND/11488014; Temperature: -55...+125°C
C42 = Ceramic_0603: as C23 on sheet power-converter; Package: 0603; HelpURL: https://www.digikey.com/product-detail/en/samsung-electro-mechanics/CL10B103KB8NNNC/1276-1009-1-ND/3889095; Temperature: -55...+125°C
C46 C47 = Ceramic_0603: Manufacturer: Samsung; PartNumber: CL10C120JB8NNNC; ValueManufacturerPartNumber: Ceramic capacitor, 12pF, NPO, ±10%, 50V, 0603, -55...+125°C; TypeCapacitor: Ceramic capacitor; Tolerance: ±10%; TypeDielectric: NPO; Package: 0603; HelpURL: https://www.digikey.com/product-detail/en/samsung-electro-mechanics/CL10C120JB8NNNC/1276-1254-1-ND/3889340; Temperature: -55...+125°C
C48 = Ceramic_0603: Manufacturer: Samsung; PartNumber: CL10B105KA8NNNC; ValueManufacturerPartNumber: Ceramic capacitor, 1μF, X7R, ±10%, 25V, 0603, -55...+125°C; TypeCapacitor: Ceramic capacitor; Tolerance: ±10%; TypeDielectric: X7R; Package: 0603; HelpURL: https://www.digikey.com/product-detail/en/samsung-electro-mechanics/CL10B105KA8NNNC/1276-1184-1-ND/3889270; Temperature: -55...+125°C
D7 = STM32F334C8T6: Cortex-M4; Manufacturer: STMicroelectronics; ValueManufacturerPartNumber: IC microcontroller, 32-Bit, Cortex-M4, 72MHz, 16KB, 12KB, 2...3.6V, -40...+85°C, 48-LQFP; Supply: 2...3.6V; Speed: 72MHz; CoreSize: 32-Bit; MemoryROM: 16KB; MemoryRAM: 12KB; HelpURL: https://www.digikey.com/en/products/detail/stmicroelectronics/STM32F334C4T6/4989170?s=N4IgTCBcDaIMoBUCyBmMAxFKAsBhbCAbCALoC%2BQA; Package: 48-LQFP; ComponentType: IC microcontroller; Temperature: -40...+85°C; CoreProcessor: Cortex-M4
D8 = 24AA01T: EEPROM; Manufacturer: Microchip Technology; ValueManufacturerPartNumber: IC memory, EEPROM, 1KB (128x8), 400 kHz, I2C, 1.7...5.5V, -40...+85°C, SOT-23-5; Supply: 1.7...5.5V; Speed: 400 kHz; InterfaceData: I2C; MemorySize: 1KB (128x8); HelpURL: https://www.digikey.com/product-detail/en/microchip-technology/24AA01T-I-OT/24AA01T-I-OTCT-ND/857670; Package: SOT-23-5; ComponentType: IC memory; Temperature: -40...+85°C; MemoryType: EEPROM
D9 = SN65HVD231DR: CAN; Manufacturer: Texas Instruments; ValueManufacturerPartNumber: IC CAN transceiver, 1Mbps, Half-duplex, 3...3.6V, -40...+85°C, 8-SOIC; Supply: 3...3.6V; DataRate: 1Mbps; TypeDuplex: Half-duplex; HelpURL: https://www.digikey.com/product-detail/en/texas-instruments/SN65HVD231DR/296-26343-1-ND/2254977; Package: 8-SOIC; ComponentType: IC CAN transceiver; Temperature: -40...+85°C; PartNumber: SN65HVD231DR
L5 = Inductor_0603: Manufacturer: Murata Electronics; PartNumber: LQM18FN100M00D; ValueManufacturerPartNumber: Fixed inductor, 10μH, ±20%, 0603, 50mA, -55...+125°C; TypeInductor: Fixed inductor; MaxCurrent: 50mA; Package: 0603; HelpURL: https://www.digikey.com/product-detail/en/murata-electronics-north-america/LQM18FN100M00D/490-4025-1-ND/1016285; Temperature: -55...+125°C
R45-R47 R54 R55 R57 R58 R60 R61 R63 R64 = Resistor_0603: as R31 on sheet power-converter; Package: 0603; HelpURL: https://www.digikey.com/product-detail/en/yageo/RC0603FR-071KL/311-1-00KHRCT-ND/729790; Temperature: -55...+125°C
R48 R50 R52 = Resistor_0603: as R16 on sheet power-converter; Package: 0603; HelpURL: https://www.digikey.com/en/products/detail/yageo/AC0603FR-0710KL/2827814; Temperature: -55...+125°C
R49 R51 R53 R56 R59 R62 = Resistor_0603: as R20 on sheet power-converter; Package: 0603; HelpURL: https://www.digikey.com/product-detail/en/yageo/RC0603JR-07120RL/311-120GRCT-ND/729653; Temperature: -55...+125°C
SB1 = Button_tactile: Manufacturer: C&K; ValueManufacturerPartNumber: Tactile button, 6x3.5mm; PartNumber: PTS636 SM43; TypeButton: Tactile button; HelpURL: https://www.digikey.com/product-detail/en/c-k/PTS636-SM43-SMTR-LFS/CKN12310-1-ND/10071745; Package: 6x3.5mm
VD7 = LED_single: Manufacturer: Wurth; ValueManufacturerPartNumber: LED, 20mA, 2V, 0603, -55...+150°C; PartNumber: 150060VS75000; TypeDiode: LED; Current: 20mA; VoltageDrop: 2V; Package: 0603; HelpURL: https://www.digikey.com/product-detail/en/w-rth-elektronik/150060VS75000/732-4980-1-ND/4489904; Temperature: -55...+150°C
VD8 VD11 VD13-VD15 = LED_single: Manufacturer: Wurth; ValueManufacturerPartNumber: LED, 20 mA, 2V, 0603, -55...+150°C; PartNumber: 150060RS75000; TypeDiode: LED; Current: 20 mA; VoltageDrop: 2V; Package: 0603; HelpURL: https://www.digikey.com/product-detail/en/w-rth-elektronik/150060RS75000/732-4978-1-ND/4489899; Temperature: -55...+150°C
VD9 = TVS_array: Manufacturer: STMicroelectronics; ValueManufacturerPartNumber: TVS diode, 24V, 230W peak, 3A, 13pF, SOT-23, -40...+150°C; TypeDiode: TVS diode; Current: 230W peak; VoltageDrop: 3A; RecoveryTime: 13pF; Package: SOT-23; HelpURL: https://www.digikey.com/product-detail/en/stmicroelectronics/ESDCAN06-2BLY/497-19090-1-ND/10057130; Temperature: -40...+150°C
VD10 = LED_single: Manufacturer: Wurth; ValueManufacturerPartNumber: LED, 20mA, 3.2V, 0603, -55...+150°C; PartNumber: 150060BS75000; TypeDiode: LED; Current: 20mA; VoltageDrop: 3.2V; Package: 0603; HelpURL: https://www.digikey.com/product-detail/en/w-rth-elektronik/150060BS75000/732-4966-1-ND/4489893; Temperature: -55...+150°C
VD12 = LED_single: Manufacturer: Wurth; ValueManufacturerPartNumber: LED, 20mA, 2V, 0603, -55...+150°C; PartNumber: 150060YS75000; TypeDiode: LED; Current: 20mA; VoltageDrop: 2V; Package: 0603; HelpURL: https://www.digikey.com/product-detail/en/wurth-electronics-inc/150060YS75000/732-4981-1-ND/4489907; Temperature: -55...+150°C
X5 X6 = CWF-2: Manufacturer: Connfly; ValueManufacturerPartNumber: Connector, 2pin, 2.54mm, 250VAC, 3A; TypeConnector: Connector; VoltageMax: 250VAC; Pitch: 2.54mm; CurrentMax: 3A; Multichannel: 2pin; HelpURL: https://www.chipdip.ru/product/cwf-2; PartNumber: CWF-2
X7 = Connector_SM05B: Manufacturer: JST; ValueManufacturerPartNumber: Connector, 5pin, 1.25mm, 50VDC, 1A; PartNumber: SM05B-GHS; VoltageMax: 50VDC; Pitch: 1.25mm; CurrentMax: 1A; Multichannel: 5pin; HelpURL: https://www.digikey.com/product-detail/en/jst-sales-america-inc/SM05B-GHS-TB-LF-SN/455-1567-1-ND/807835; TypeConnector: Connector
X8 = CWF-4: Manufacturer: Connfly; ValueManufacturerPartNumber: Connector, 4pin, 2.54mm, 250VAC, 3A; TypeConnector: Connector; VoltageMax: 250VAC; Pitch: 2.54mm; CurrentMax: 3A; Multichannel: 4pin; HelpURL: https://www.chipdip.ru/product/cwf-4; PartNumber: CWF-4
X9 = Connector_RJ45: Manufacturer: Wurth; ValueManufacturerPartNumber: Etherner RJ-45 connector; PartNumber: 615008137421; AnalogComponent: DS1128-09-S8B8S (Connfly); HelpURL: https://www.digikey.com/product-detail/en/w-rth-elektronik/615008137421/732-2112-ND/2060608; TypeConnector: Etherner RJ-45 connector
Z1 = Crystal_3225: Manufacturer: ECS; PartNumber: ECS-80-12-33-JGN-TR; ValueManufacturerPartNumber: Crystal, 8MHz, 12pF, ±30ppm, case 3225, -40...+85°C; LoadCapacitance: 12pF; Tolerance: ±30ppm; Package: case 3225; HelpURL: https://www.digikey.com/product-detail/en/ecs-inc/ECS-80-12-33-JGN-TR/50-ECS-80-12-33-JGN-CT-ND/10478769; Temperature: -40...+85°C; TypeOscilator: Crystal

## Sheet wi-fi.SchDoc
size 420 x 297 mm; Address1: Address1; Address2: Address2; Address3: Address3; Address4: Address4; DocumentNumber: АБВГ.123456.001 Э3; SheetNumber: 3; SheetTotal: 4; Scale: 1:1; DocumentType: Схема электрическая принципиальная; FirstReferrence: АБВГ.123456.001
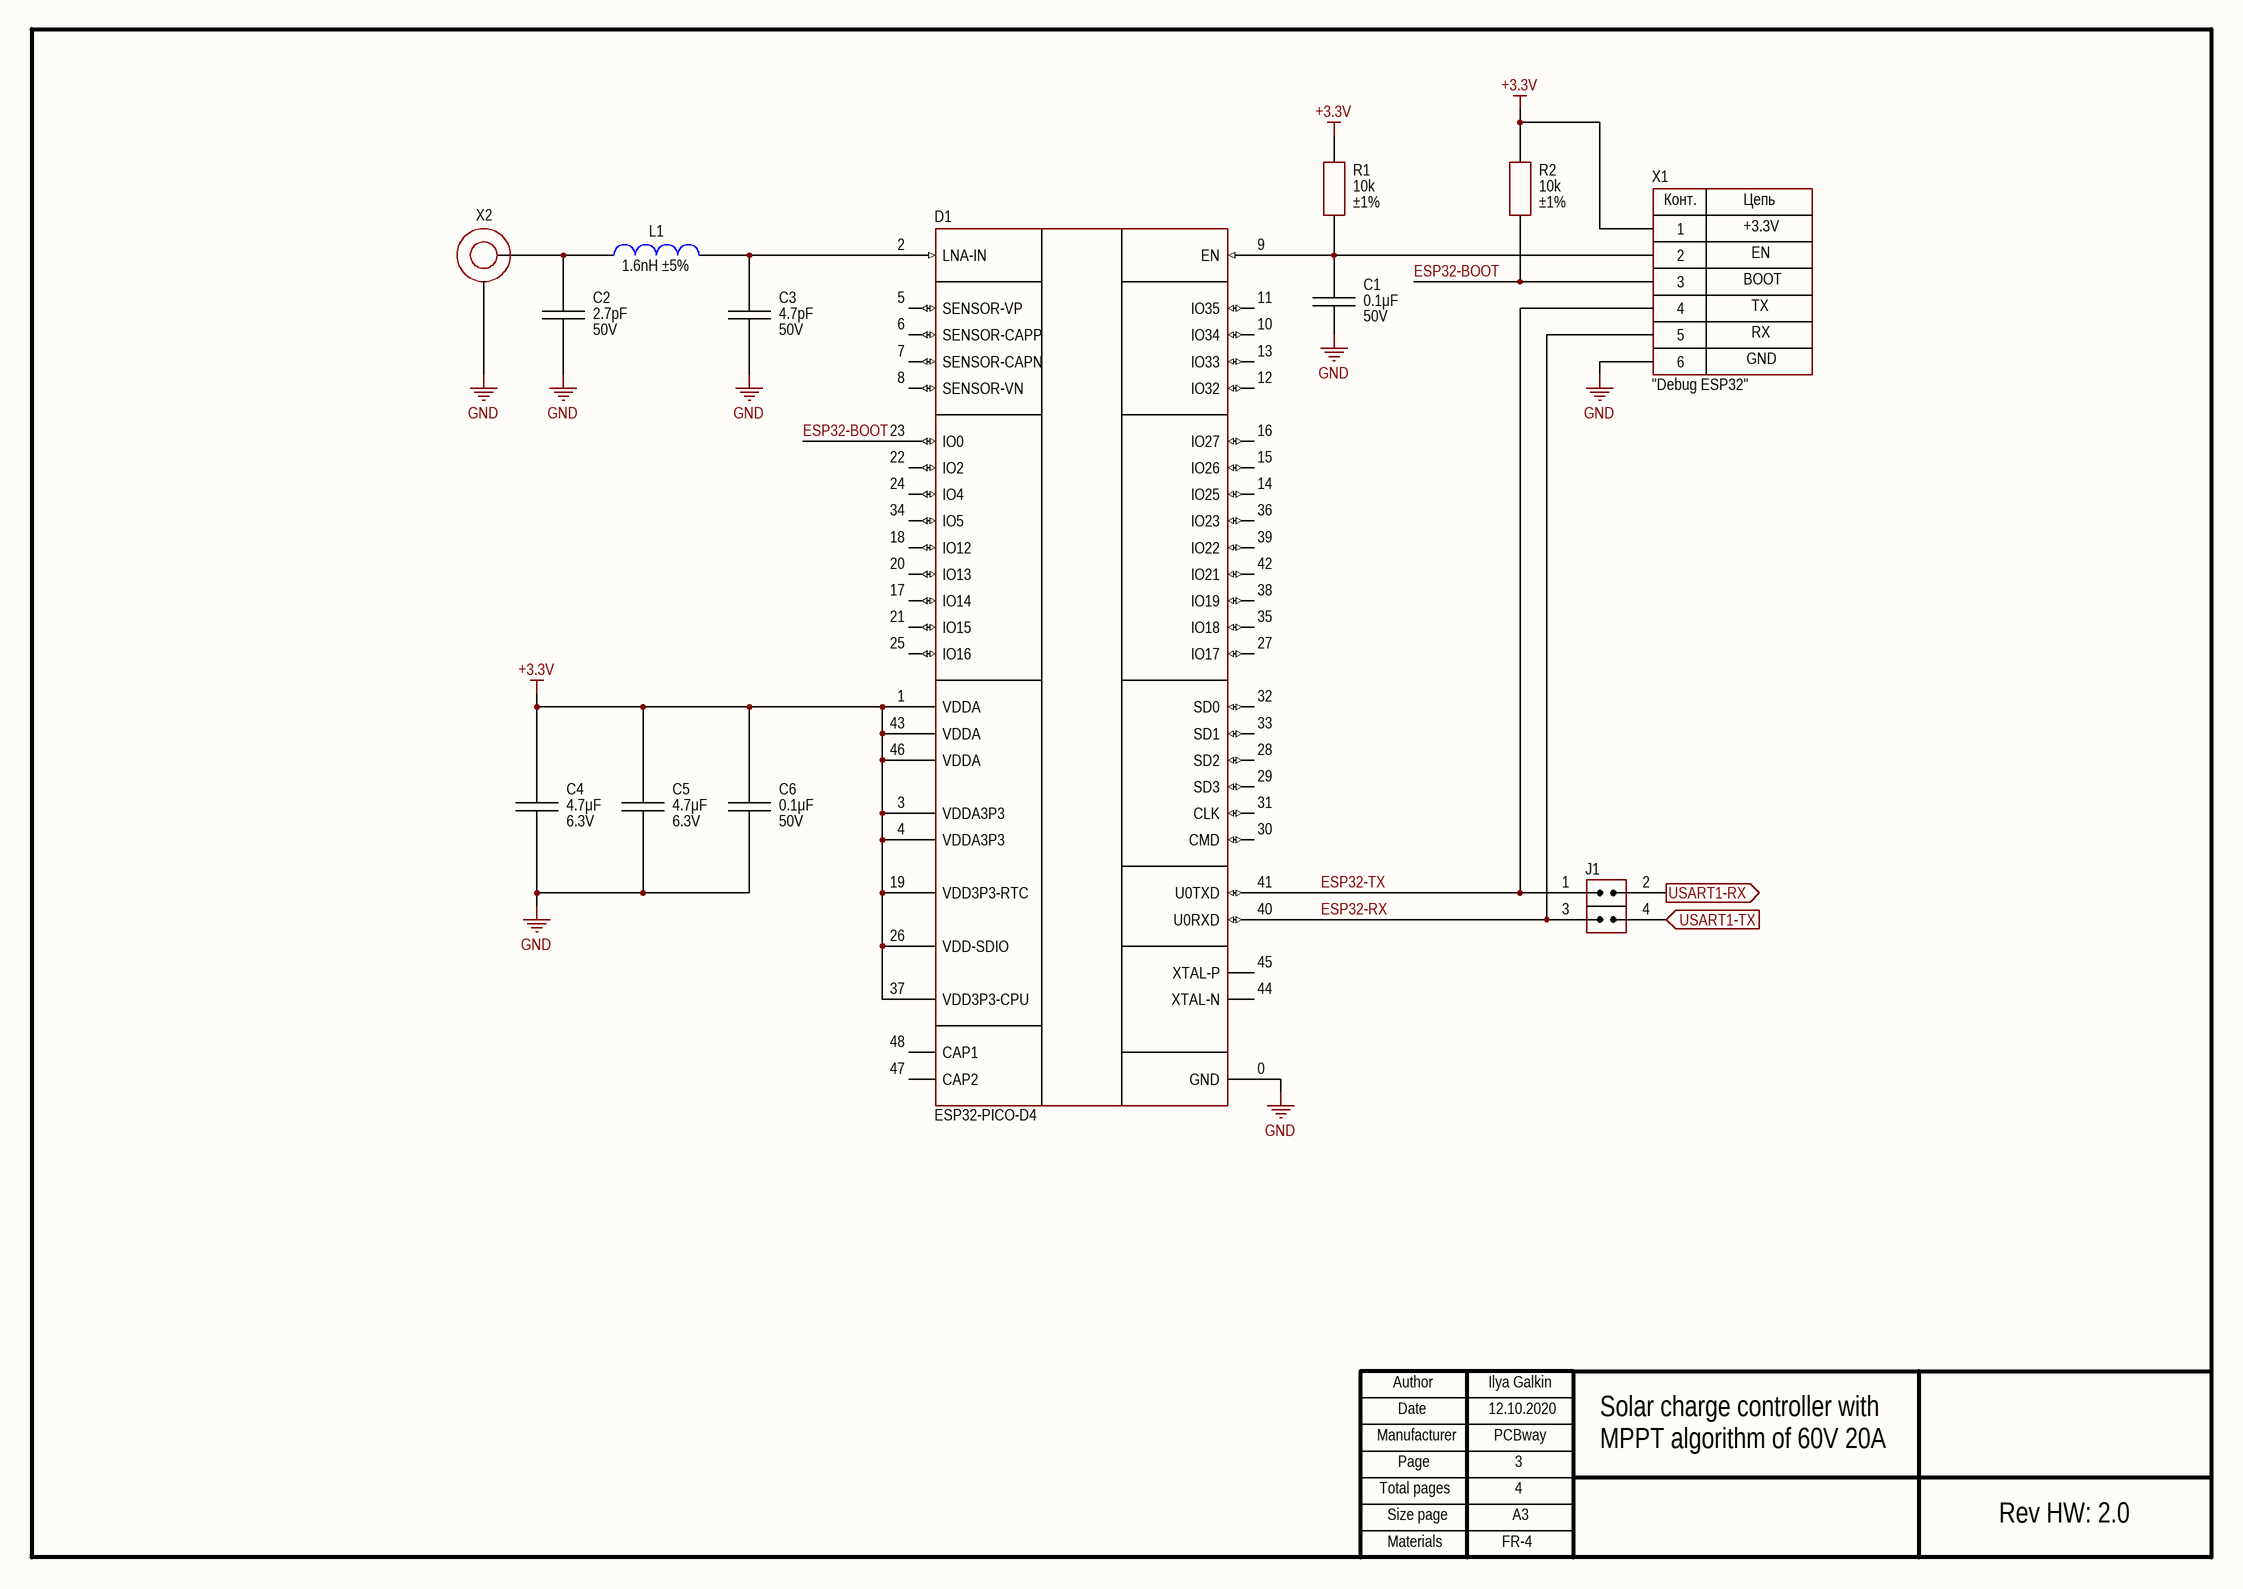
[diagram p2: wi-fi.SchDoc]

### Parts
C1  value 0.1μF  Voltage: 50V  [CAP: 0603]
C2  value 2.7pF  Voltage: 50V  [CAP: 0603]
C3  value 4.7pF  Voltage: 50V  [CAP: 0603]
C4  value 4.7μF  Voltage: 6.3V  [CAP: 0603]
C5  value 4.7μF  Voltage: 6.3V  [CAP: 0603]
C6  value 0.1μF  Voltage: 50V  [CAP: 0603]
D1  (no value)  [48-LGA (7x7)]
J1  (no value)  [CON: JUMPER x2]
L1  value 1.6nH  Tolerance: ±5%  [IND: 0603]
R1  value 10k  Tolerance: ±1%  [RES: 0603]
R2  value 10k  Tolerance: ±1%  [RES: 0603]
X1  CommentText: "Debug ESP32"  [CON: SM06B-GHS]
X2  (no value)  [CON: SMA]

### Ports
USART1-RX (out), USART1-TX (in)

### Nets
+3.3V: C4.2 C5.2 C6.2 D1.1(VDDA) D1.3(VDDA3P3) D1.4(VDDA3P3) D1.19(VDD3P3-RTC) D1.26(VDD-SDIO) D1.37(VDD3P3-CPU) D1.43(VDDA) D1.46(VDDA) R1.2 R2.2 X1.1
GND: C1.1 C2.1 C3.1 C4.1 C5.1 C6.1 D1.0(GND) X1.6 X2.2
ESP32-BOOT: D1.23(IO0) R2.1 X1.3
ESP32-RX: D1.40(U0RXD) J1.3(IN) X1.5
ESP32-TX: D1.41(U0TXD) J1.1(IN) X1.4
NetC1_2: C1.2 D1.9(EN) R1.1 X1.2
NetC2_2: C2.2 L1.2 X2.1
NetC3_2: C3.2 D1.2(LNA-IN) L1.1
NetD7_42: J1.4(IN) ; port USART1-TX
NetD7_43: J1.2(IN) ; port USART1-RX

Not connected (* = marked no-connect by the designer): D1 5(SENSOR-VP) 6(SENSOR-CAPP) 7(SENSOR-CAPN) 8(SENSOR-VN) 10(IO34) 11(IO35) 12(IO32) 13(IO33) 14(IO25) 15(IO26) 16(IO27) 17(IO14) 18(IO12) 20(IO13) 21(IO15) 22(IO2) 24(IO4) 25(IO16) 27(IO17) 28(SD2) 29(SD3) 30(CMD) 31(CLK) 32(SD0) 33(SD1) 34(IO5) 35(IO18) 36(IO23) 38(IO19) 39(IO22) 42(IO21) 44(XTAL-N) 45(XTAL-P) 47(CAP2) 48(CAP1)

### Notes on the sheet
- +3.3V
- EN
- BOOT
- TX
- GND
- RX
- Ilya Galkin
- 12.10.2020
- PCBway
- 3
- Solar charge controller with
- MPPT algorithm of 60V 20A
- 4
- Rev HW: 2.0
- FR-4
- Author
- Manufacturer
- Date
- Page
- Total pages
- Size page
- A3
- Materials
- (in symbol Connector_SM06B) Конт.; Цепь

### Library data of the parts
C1 C6 = Ceramic_0603: as C22 on sheet power-converter; Package: 0603; HelpURL: https://www.digikey.com/product-detail/en/samsung-electro-mechanics/CL10B104KB8WPND/1276-CL10B104KB8WPNDCT-ND/11488014; Temperature: -55...+125°C
C2 = Ceramic_0603: Manufacturer: Samsung; PartNumber: CL10C2R7CB81PNC; ValueManufacturerPartNumber: Ceramic capacitor, 2.7pF, NPO, ±0.25pF, 50V, 0603, -55...+125°C; TypeCapacitor: Ceramic capacitor; Tolerance: ±0.25pF; TypeDielectric: NPO; Package: 0603; HelpURL: https://www.digikey.com/product-detail/en/samsung-electro-mechanics/CL10C2R7CB81PNC/1276-6554-1-ND/5961413; Temperature: -55...+125°C
C3 = Ceramic_0603: Manufacturer: Samsung; PartNumber: CL10C4R7BB8NNNC; ValueManufacturerPartNumber: Ceramic capacitor, 4.7pF, NPO, ±0.1pF, 50V, 0603, -55...+125°C; TypeCapacitor: Ceramic capacitor; Tolerance: ±0.1pF; TypeDielectric: NPO; Package: 0603; HelpURL: https://www.digikey.com/product-detail/en/samsung-electro-mechanics/CL10C4R7BB8NNNC/1276-1792-1-ND/3889878; Temperature: -55...+125°C
C4 C5 = Ceramic_0603: as C35 on sheet dsp; Package: 0603; HelpURL: https://www.digikey.com/en/products/detail/samsung-electro-mechanics/CL10B475KQ8NQNC/3887745; Temperature: -55...+125°C
D1 = ESP32-PICO-D4: Wi-Fi+BT; Manufacturer: Espressif Systems; ValueManufacturerPartNumber: IC RF transceiver, 802.11b/g/n + Bluetooth v4.2, 2.4GHz, 32-Bit, Xtensa LX6, 4Mb, 520KB, 2.7...3.6V, -40...+85°C, 48-LGA; Supply: 2.7...3.6V; CoreSpeed: 600 DMIPS; CoreSize: 32-Bit; MemoryROM: 4Mb; MemoryRAM: 520KB; CoreProcessor: Xtensa LX6; Frequency: 2.4GHz; TypeProtocol: 802.11b/g/n + Bluetooth v4.2; HelpURL: https://www.digikey.com/product-detail/en/espressif-systems/ESP32-PICO-D4/1904-1029-1-ND/9381738; Package: 48-LGA; ComponentType: IC RF transceiver; Temperature: -40...+85°C; PartNumber: ESP32-PICO-D4
J1 = Jumper_double: CommentText: "Перемычка"
L1 = Inductor_0603: Manufacturer: Murata Electronics; PartNumber: LQW18AS1N6J0ZD; ValueManufacturerPartNumber: Fixed inductor, 1.6nH, ±5%, 0603, 700mA, -55...+125°C; TypeInductor: Fixed inductor; MaxCurrent: 700mA; Package: 0603; HelpURL: https://www.digikey.com/product-detail/en/murata-electronics/LQW18AS1N6J0ZD/490-15806-1-ND/6800471; Temperature: -55...+125°C
R1 R2 = Resistor_0603: as R16 on sheet power-converter; Package: 0603; HelpURL: https://www.digikey.com/en/products/detail/yageo/AC0603FR-0710KL/2827814; Temperature: -55...+125°C
X1 = Connector_SM06B: Manufacturer: JST; ValueManufacturerPartNumber: Connector, 6pin, 1.25mm, 50VDC, 1A; PartNumber: SM06B-GHS; VoltageMax: 50VDC; Pitch: 1.25mm; CurrentMax: 1A; Multichannel: 6pin; HelpURL: https://www.digikey.com/product-detail/en/jst-sales-america-inc/SM06B-GHS-TB-LF-SN/455-1568-1-ND/807836; TypeConnector: Connector
X2 = Connector_SMA: Manufacturer: TE Connectivity; ValueManufacturerPartNumber: Connector SMA, 50 Ohm, 3GHz; PartNumber: 5-1814832-1; TypeConnector: Connector SMA; Frequency: 3GHz; Impedance: 50 Ohm; CommentText: "Wi-Fi"; HelpURL: https://www.digikey.com/product-detail/en/te-connectivity-amp-connectors/5-1814832-1/A97594-ND/1755982

## Sheet supply.SchDoc
size 420 x 297 mm; Address1: Address1; Address2: Address2; Address3: Address3; Address4: Address4; DocumentNumber: АБВГ.123456.001 Э3; SheetNumber: 4; SheetTotal: 4; Scale: 1:1; DocumentType: Схема электрическая принципиальная; FirstReferrence: АБВГ.123456.001
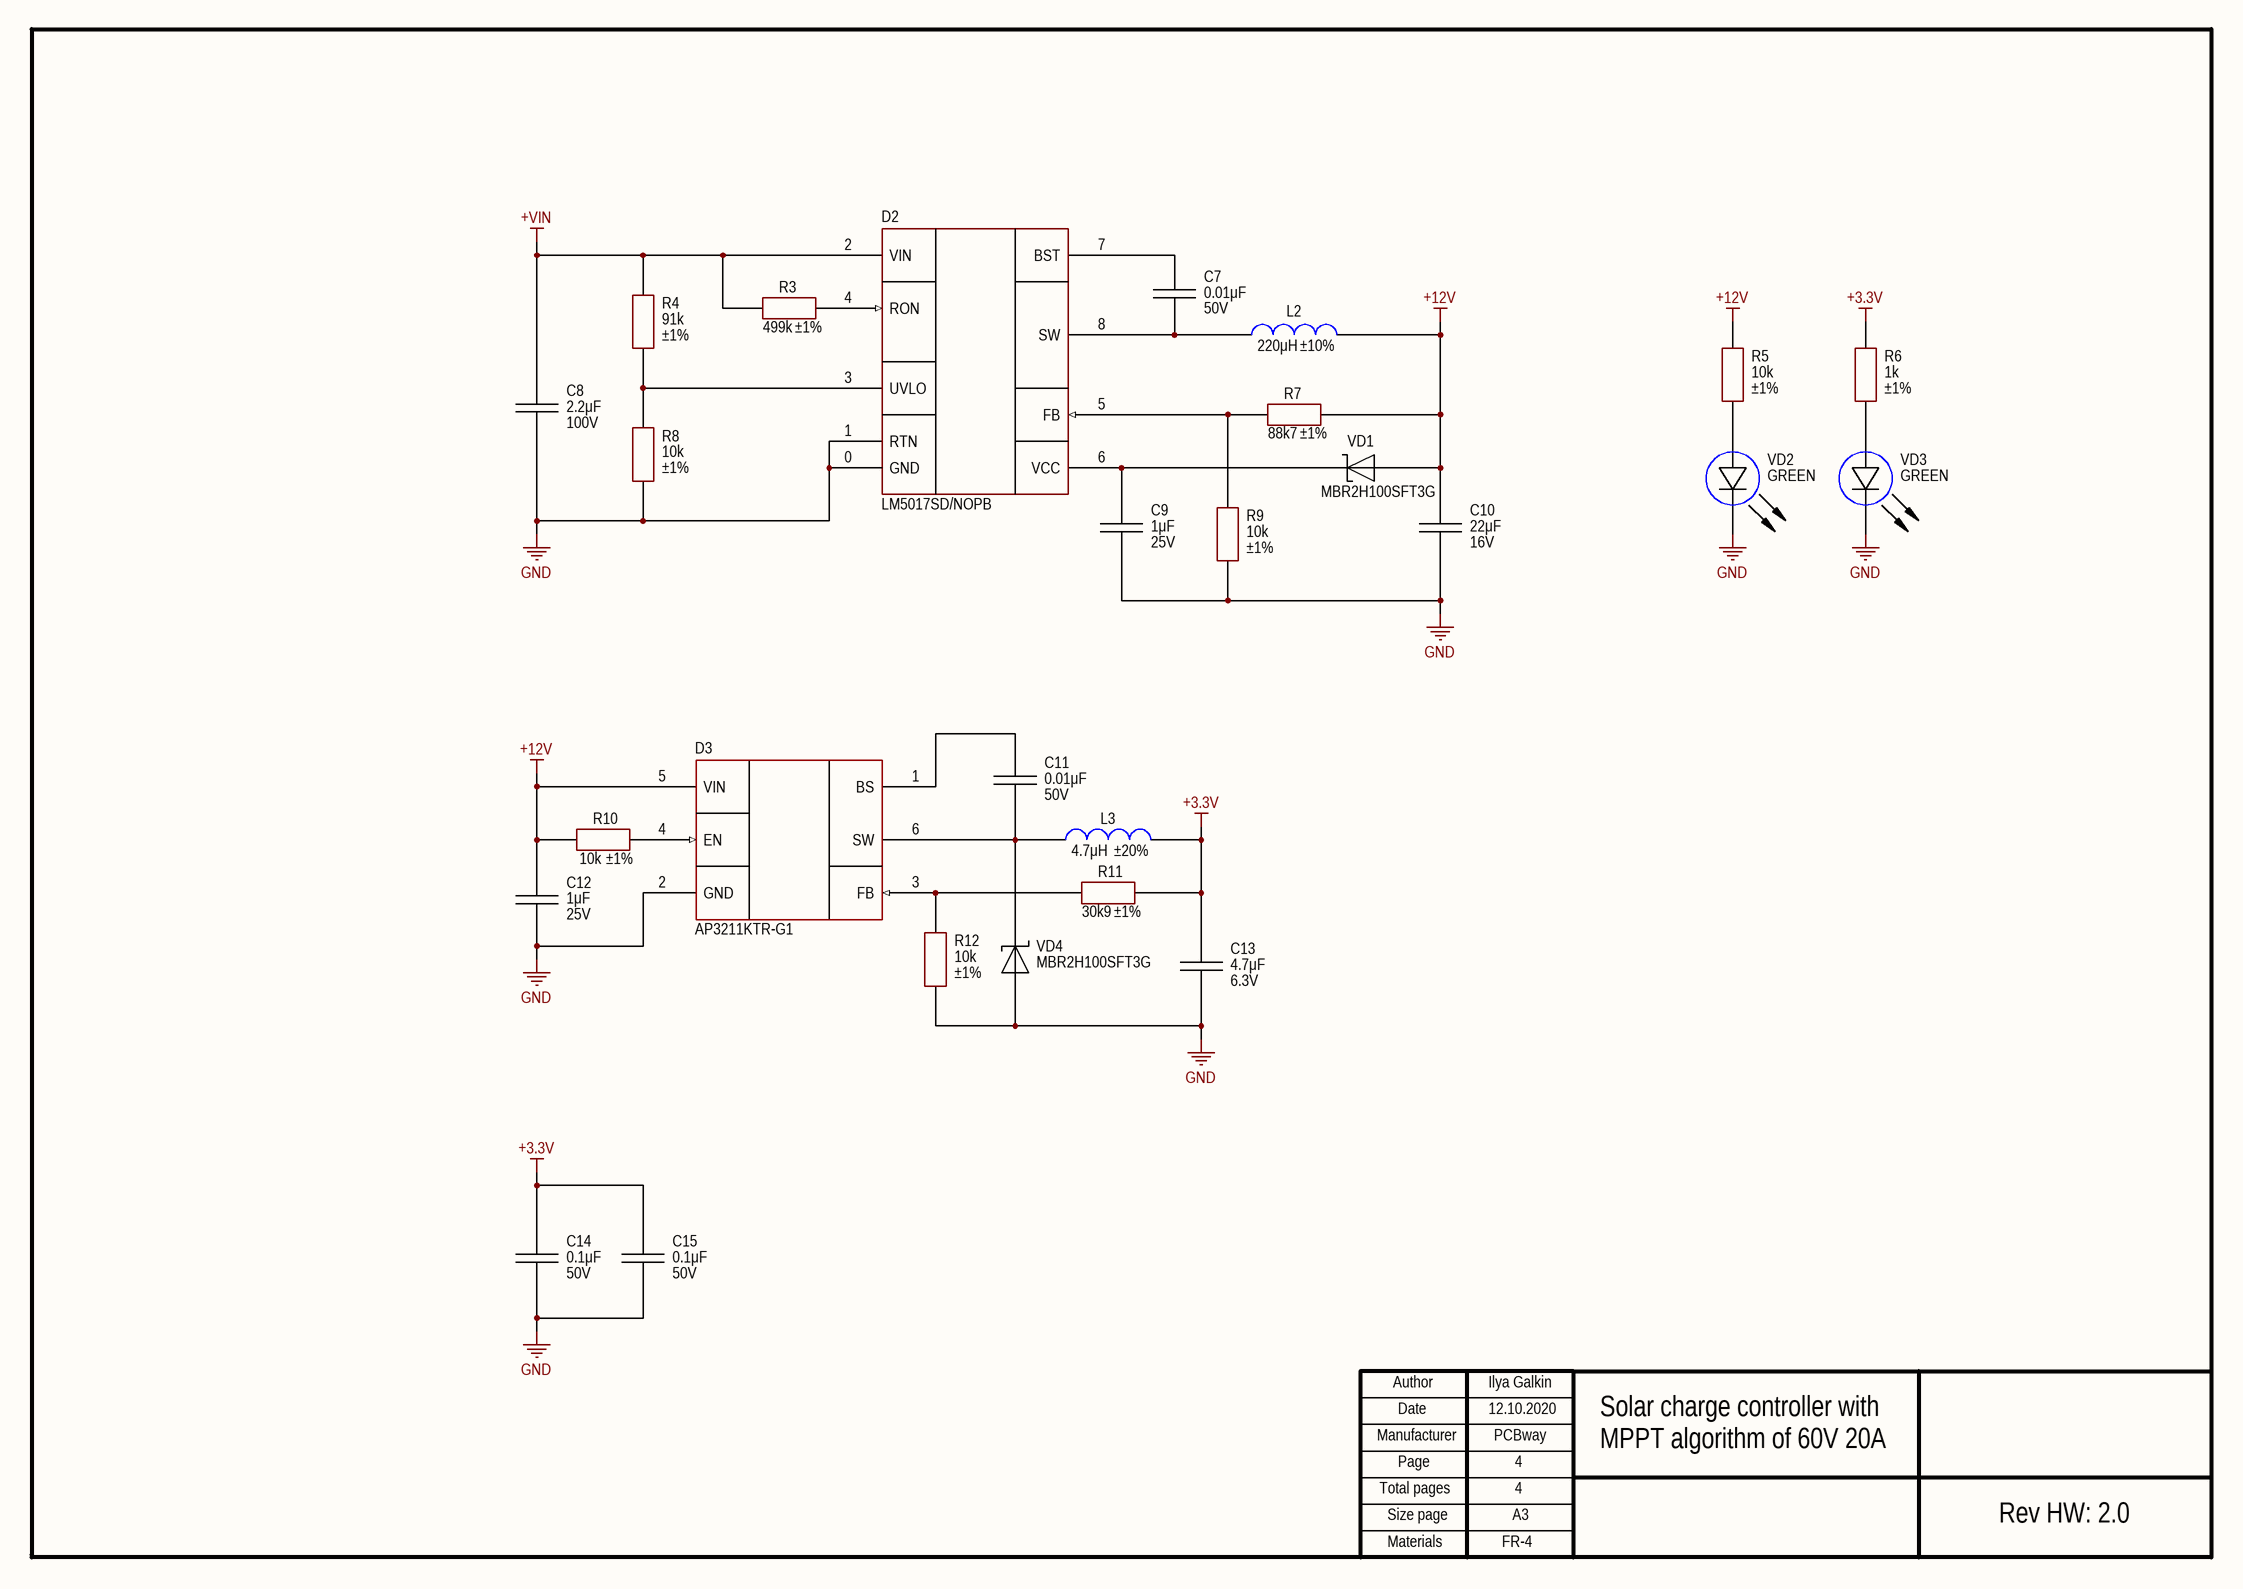
[diagram p3: supply.SchDoc]

### Parts
C7  value 0.01μF  Voltage: 50V  [CAP: 0603]
C8  value 2.2μF  Voltage: 100V  [CAP: 1210]
C9  value 1μF  Voltage: 25V  [CAP: 0603]
C10  value 22μF  Voltage: 16V  [CAP: 1210]
C11  value 0.01μF  Voltage: 50V  [CAP: 0603]
C12  value 1μF  Voltage: 25V  [CAP: 0603]
C13  value 4.7μF  Voltage: 6.3V  [CAP: 0603]
C14  value 0.1μF  Voltage: 50V  [CAP: 0603]
C15  value 0.1μF  Voltage: 50V  [CAP: 0603]
D2  PartNumber: LM5017SD/NOPB  [8-WSON (4x4)]
D3  (no value)  [SOT23-6]
L2  value 220μH  Tolerance: ±10%  [IND: SDR0805]
L3  value 4.7μH  Tolerance: ±20%  [IND: CD32]
R3  value 499k  Tolerance: ±1%  [RES: 0603]
R4  value 91k  Tolerance: ±1%  [RES: 0603]
R5  value 10k  Tolerance: ±1%  [RES: 0603]
R6  value 1k  Tolerance: ±1%  [RES: 0603]
R7  value 88k7  Tolerance: ±1%  [RES: 0603]
R8  value 10k  Tolerance: ±1%  [RES: 0603]
R9  value 10k  Tolerance: ±1%  [RES: 0603]
R10  value 10k  Tolerance: ±1%  [RES: 0603]
R11  value 30k9  Tolerance: ±1%  [RES: 0603]
R12  value 10k  Tolerance: ±1%  [RES: 0603]
VD1  PartNumber: MBR2H100SFT3G  [DIODE: SOD123F]
VD2  Color: GREEN  [LED: 0603G]
VD3  Color: GREEN  [LED: 0603G]
VD4  PartNumber: MBR2H100SFT3G  [DIODE: SOD123F]

### Nets
+3.3V: C13.2 C14.2 C15.2 L3.1 R6.2 R11.1
+12V: C10.2 C12.2 D3.5(VIN) L2.1 R5.2 R7.1 R10.2 VD1.1
+VIN: C8.2 D2.2(VIN) R3.2 R4.2
GND: C8.1 C9.1 C10.1 C12.1 C13.1 C14.1 C15.1 D2.0(GND) D2.1(RTN) D3.2(GND) R8.1 R9.1 R12.1 VD2.2(C) VD3.2(C) VD4.1
NetC7_1: C7.1 D2.8(SW) L2.2
NetC7_2: C7.2 D2.7(BST)
NetC9_2: C9.2 D2.6(VCC) VD1.2
NetC11_1: C11.1 D3.6(SW) L3.2 VD4.2
NetC11_2: C11.2 D3.1(BS)
NetD2_3: D2.3(UVLO) R4.1 R8.2
NetD2_4: D2.4(RON) R3.1
NetD2_5: D2.5(FB) R7.2 R9.2
NetD3_3: D3.3(FB) R11.2 R12.2
NetD3_4: D3.4(EN) R10.1
NetR5_1: R5.1 VD2.1(A)
NetR6_1: R6.1 VD3.1(A)

### Notes on the sheet
- Ilya Galkin
- 12.10.2020
- PCBway
- 4
- Solar charge controller with
- MPPT algorithm of 60V 20A
- Rev HW: 2.0
- FR-4
- Author
- Manufacturer
- Date
- Page
- Total pages
- Size page
- A3
- Materials

### Library data of the parts
C7 C11 = Ceramic_0603: as C23 on sheet power-converter; Package: 0603; HelpURL: https://www.digikey.com/product-detail/en/samsung-electro-mechanics/CL10B103KB8NNNC/1276-1009-1-ND/3889095; Temperature: -55...+125°C
C8 = Ceramic_1210: Manufacturer: Samsung; PartNumber: CL32B225KCJSNNE; ValueManufacturerPartNumber: Ceramic capacitor, 2.2μF, X7R, ±10%, 100V, 1210, -55...+125°C; TypeCapacitor: Ceramic capacitor; Tolerance: ±10%; TypeDielectric: X7R; Package: 1210; HelpURL: https://www.digikey.com/en/products/detail/samsung-electro-mechanics/CL32B225KCJSNNE/3889020; Temperature: -55...+125°C
C9 C12 = Ceramic_0603: as C48 on sheet dsp; Package: 0603; HelpURL: https://www.digikey.com/product-detail/en/samsung-electro-mechanics/CL10B105KA8NNNC/1276-1184-1-ND/3889270; Temperature: -55...+125°C
C10 = Ceramic_1210: Manufacturer: Samsung; PartNumber: CL32B226KOJNNNE; ValueManufacturerPartNumber: Ceramic capacitor, 22μF, X7R, ±10%, 16V, 1210, -55...+125°C; TypeCapacitor: Ceramic capacitor; Tolerance: ±10%; TypeDielectric: X7R; Package: 1210; HelpURL: https://www.digikey.com/en/products/detail/samsung-electro-mechanics/CL32B226KOJNNNE/3887513; Temperature: -55...+125°C
C13 = Ceramic_0603: as C35 on sheet dsp; Package: 0603; HelpURL: https://www.digikey.com/en/products/detail/samsung-electro-mechanics/CL10B475KQ8NQNC/3887745; Temperature: -55...+125°C
C14 C15 = Ceramic_0603: as C22 on sheet power-converter; Package: 0603; HelpURL: https://www.digikey.com/product-detail/en/samsung-electro-mechanics/CL10B104KB8WPND/1276-CL10B104KB8WPNDCT-ND/11488014; Temperature: -55...+125°C
D2 = LM5017SD: Buck converter; Manufacturer: Texas Instruments; ValueManufacturerPartNumber: DC/DC buck converter, input 7.5...100V, 1MHz, output 1.225...90V, 0.6A, -40...+125°C, 8-WSON; VoltageInput: input 7.5...100V; Frequency: 1MHz; CurrentOutput: 0.6A; VoltageOutput: output 1.225...90V; HelpURL: https://www.digikey.com/product-detail/en/texas-instruments/LM5017SD-NOPB/LM5017SD-NOPBCT-ND/3137455; Package: 8-WSON; ComponentType: DC/DC buck converter; Temperature: -40...+125°C
D3 = AP3211KTR-G1: Buck converter; Manufacturer: Diodes Incorporated; ValueManufacturerPartNumber: DC/DC buck converter, input 4.5...18V, 1.4MHz, output 0.81...15V, 1.5A, -40...+85°C, SOT23-6; VoltageInput: input 4.5...18V; Frequency: 1.4MHz; CurrentOutput: 1.5A; VoltageOutput: output 0.81...15V; HelpURL: https://www.digikey.com/product-detail/en/diodes-incorporated/AP3211KTR-G1/AP3211KTR-G1DICT-ND/4505305; Package: SOT23-6; ComponentType: DC/DC buck converter; Temperature: -40...+85°C; PartNumber: AP3211KTR-G1
L2 = Inductor_SDR0805: Manufacturer: Bourns; PartNumber: SDR0805-221KL; ValueManufacturerPartNumber: Fixed inductor, 220μH, ±10%, SDR0805, 490mA, -40...+125°C; TypeInductor: Fixed inductor; MaxCurrent: 490mA; Package: SDR0805; HelpURL: https://www.digikey.com/product-detail/en/bourns-inc/SDR0805-221KL/SDR0805-221KLCT-ND/2127164; Temperature: -40...+125°C
L3 = Inductor_CD32: Manufacturer: YJYCOIN; PartNumber: CD32YP0302-4R7M; ValueManufacturerPartNumber: Fixed inductor, 4.7μH, ±20%, CD32 series, 1.5A, -40...+125°C; TypeInductor: Fixed inductor; MaxCurrent: 1.5A; Package: CD32 series; HelpURL: https://lcsc.com/product-detail/New-Arrivals_YJYCOIN-CD32YP0302-4R7M_C492259.html; Temperature: -40...+125°C
R3 = Resistor_0603: Manufacturer: Yageo; PartNumber: RC0603FR-07499KL; ValueManufacturerPartNumber: Resistor film, 499k, ±1%, 0603, 0.1W, -55...+125°C; TypeResistor: Resistor film; Power: 0.1W; Package: 0603; HelpURL: https://www.digikey.com/en/products/detail/yageo/RC0603FR-07499KL/727267?s=N4IgTCBcDaIEoGEAMA2JBmAYnAtEg7ACwCcxA0gDIgC6AvkA; Temperature: -55...+125°C
R4 = Resistor_0603: Manufacturer: Yageo; PartNumber: RC0603FR-0791KL; ValueManufacturerPartNumber: Resistor film, 91k, ±1%, 0603, 0.1W, -55...+125°C; TypeResistor: Resistor film; Power: 0.1W; Package: 0603; HelpURL: https://www.digikey.com/en/products/detail/yageo/RC0603FR-0791KL/727428?s=N4IgTCBcDaIEoGEAMA2JBmAYnAtEg7AJwCMA0gDIgC6AvkA; Temperature: -55...+125°C
R5 R8-R10 R12 = Resistor_0603: as R16 on sheet power-converter; Package: 0603; HelpURL: https://www.digikey.com/en/products/detail/yageo/AC0603FR-0710KL/2827814; Temperature: -55...+125°C
R6 = Resistor_0603: as R31 on sheet power-converter; Package: 0603; HelpURL: https://www.digikey.com/product-detail/en/yageo/RC0603FR-071KL/311-1-00KHRCT-ND/729790; Temperature: -55...+125°C
R7 = Resistor_0603: Manufacturer: Yageo; PartNumber: RC0603FR-0788K7L; ValueManufacturerPartNumber: Resistor film, 88k7, ±1%, 0603, 0.1W, -55...+125°C; TypeResistor: Resistor film; Power: 0.1W; Package: 0603; HelpURL: https://www.digikey.com/en/products/detail/yageo/RC0603FR-0788K7L/727415?s=N4IgTCBcDaIEoGEAMA2JBmAYnAtEg7AByEDS%2BAMiALoC%2BQA; Temperature: -55...+125°C
R11 = Resistor_0603: Manufacturer: Yageo; PartNumber: RC0603FR-0730K9L; ValueManufacturerPartNumber: Resistor film, 30k9, ±1%, 0603, 0.1W, -55...+125°C; TypeResistor: Resistor film; Power: 0.1W; Package: 0603; HelpURL: https://www.digikey.com/en/products/detail/yageo/RC0603FR-0730K9L/727144; Temperature: -55...+125°C
VD1 VD4 = Schottky_single: as VD5 on sheet power-converter; Package: SOD-123F; HelpURL: https://www.digikey.com/product-detail/en/on-semiconductor/MBR2H100SFT3G/MBR2H100SFT3GOSCT-ND/3462288; Temperature: -55...+150°C
VD2 VD3 = LED_single: as VD7 on sheet dsp; Package: 0603; HelpURL: https://www.digikey.com/product-detail/en/w-rth-elektronik/150060VS75000/732-4980-1-ND/4489904; Temperature: -55...+150°C

## Nets that join several sheets
+3.3V: power-converter (D5.5 D6.5), dsp (21 pins), wi-fi (14 pins), supply (6 pins)
+12V: power-converter (5 pins), dsp (C48.2 X8.1), supply (8 pins)
+VIN: power-converter (8 pins), supply (C8.2 D2.2 R3.2 R4.2)
GND: power-converter (32 pins), dsp (49 pins), wi-fi (9 pins), supply (16 pins)
NetC23_2: power-converter (C23.2 R20.2), dsp (D7.10)
NetC29_2: power-converter (C29.2 R27.2), dsp (D7.12)
NetC31_2: power-converter (C31.2 R35.2), dsp (D7.13 D7.17)
NetC33_2: power-converter (C33.2 R41.1), dsp (D7.11 D7.18)
NetD4_1: power-converter (D4.1 R16.2), dsp (D7.29)
NetD4_2: power-converter (D4.2 R17.2), dsp (D7.30)
NetD7_14: power-converter (R31.1), dsp (D7.14)
NetD7_16: power-converter (R23.2), dsp (D7.16)
NetD7_42: dsp (D7.42), wi-fi (J1.4)
NetD7_43: dsp (D7.43), wi-fi (J1.2)